# EAGLE design Dashboard r4 (EAGLE 8.4.0)
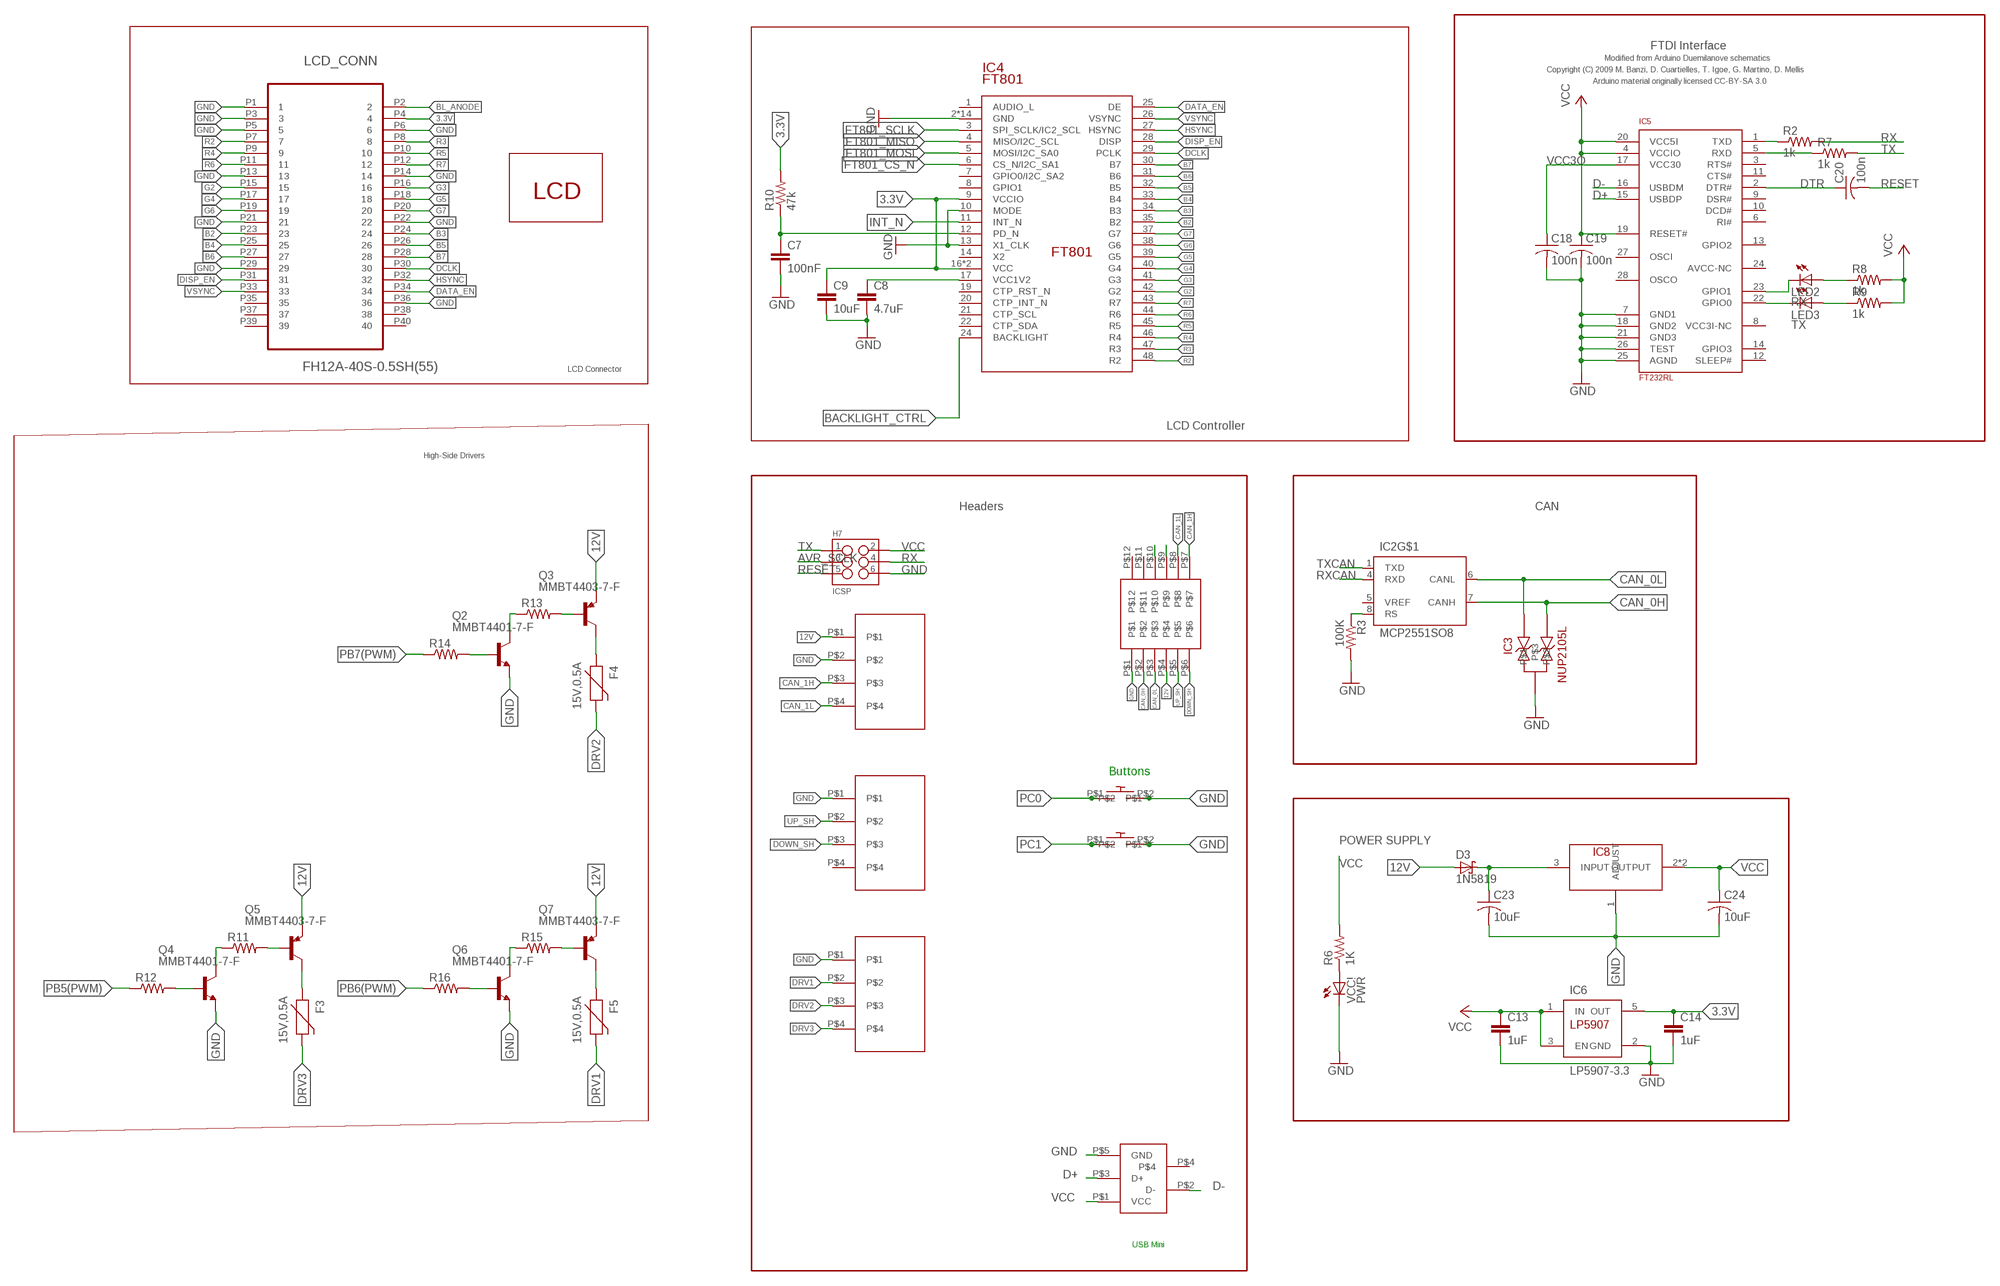
[diagram p0: schematic, sheet 1, part 1 of 2]
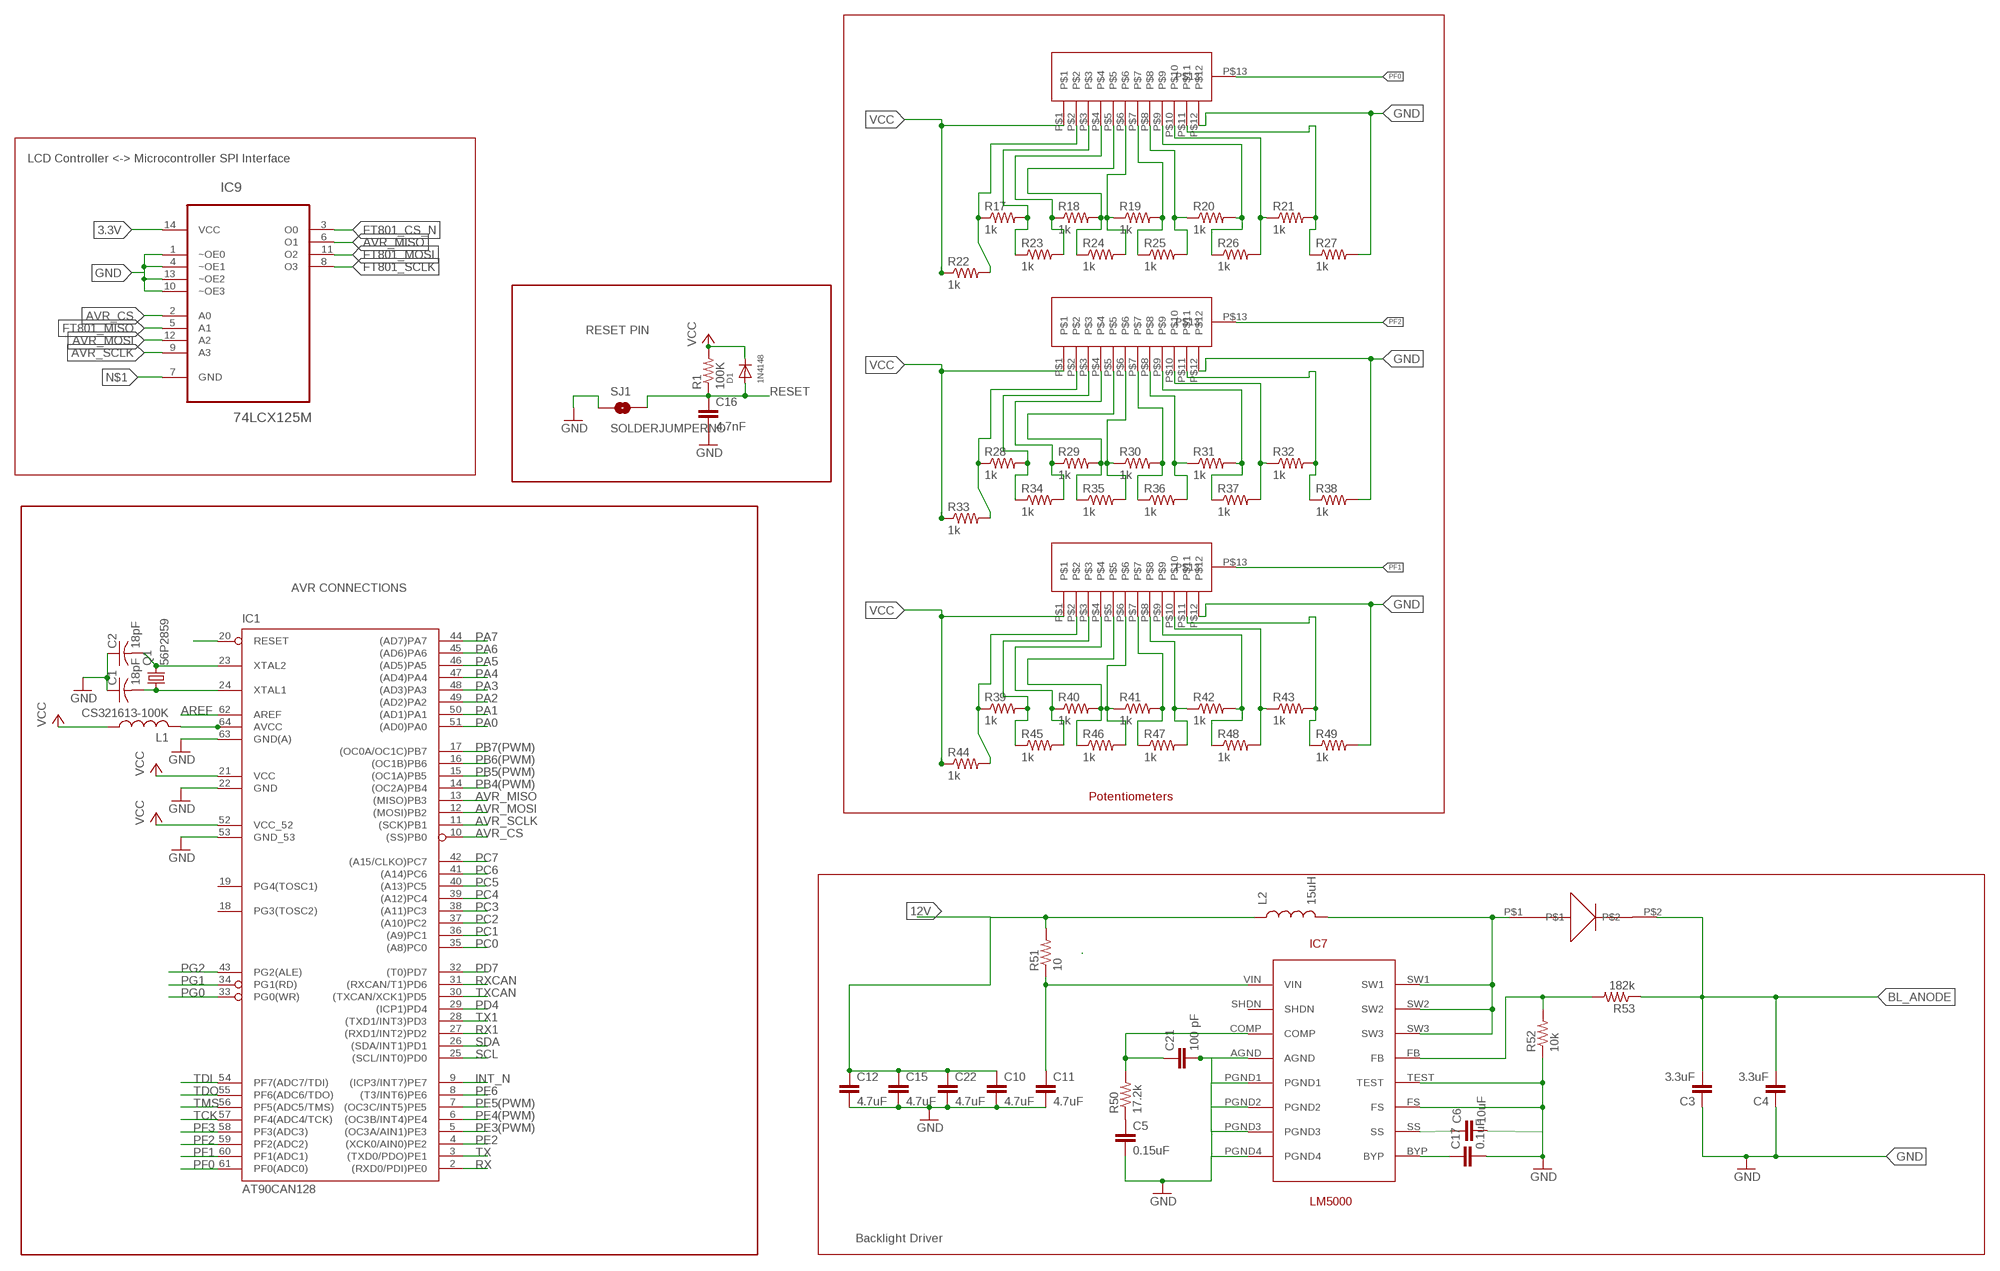
[diagram p1: schematic, sheet 1, part 2 of 2]

## Parts
C1  18pF  C-USC0805  [C0805]
C2  18pF  C-USC0805  [C0805]
C3  3.3uF  CAP0805  [0805]
C4  3.3uF  CAP0805  [0805]
C5  0.15uF  CAP0805  [0805]
C6  10uF  CAP0805  [0805]
C7  100nF  CAP0603-CAP  [0603-CAP]
C8  4.7uF  CAP0805  [0805]
C9  10uF  CAP0603-CAP  [0603-CAP]
C10  4.7uF  CAP0805  [0805]
C11  4.7uF  CAP0805  [0805]
C12  4.7uF  CAP0805  [0805]
C13  1uF  CAP0603-CAP  [0603-CAP]
C14  1uF  CAP0603-CAP  [0603-CAP]
C15  4.7uF  CAP0805  [0805]
C16  4.7nF  CAP0805  [0805]
C17  0.1uF  CAP0805  [0805]
C18  100n  C-USC0805  [C0805]
C19  100n  C-USC0805  [C0805]
C20  100n  C-USC0805  [C0805]
C21  100 pF  CAP0805  [0805]
C22  4.7uF  CAP0805  [0805]
C23  10uF  C-USC0603  [C0603]
C24  10uF  C-USC0603  [C0603]
D1  1N4148  DIODESOD-123  [SOD-123]
D2  B160-FDICT_NB  [B160-FDICT-NB]
D3  1N5819  1N5819-BSOD123  [SOD123]
F3  15V,0.5A  PTCSMD  [PTC-1206]
F4  15V,0.5A  PTCSMD  [PTC-1206]
F5  15V,0.5A  PTCSMD  [PTC-1206]
H7  ICSP  M03X2SMD_FCI  [2X3_SMD_FCI_54202-G30]
IC1  AT90CAN128  [TQFP64]
IC2  MCP2551SO8  [SO08]
IC3  NUP2105L  [SOT-23]
IC4  FT801  [RGZ48_5P15X5P15]
IC5  FT232RL  [SSOP28]
IC6  LP5907-3.3  LP5907  [SOT23-DBV]
IC7  LM5000  [LM5000]
IC8  NCP1117  [SOT-223-4]
IC9  74LCX125M  [SOIC127P600X175-14N]
J1  1734753-1_MINIUSB_CON  [1734753-1_MINIUSB_CON]
J2  EN3C12M26X  [EN3C12M26X]
J3  043650-0409  [043650-0409]
J4  043650-0409  [043650-0409]
J5  043650-0409  [043650-0409]
L1  CS321613-100K  L-USL3216C  [L3216C]
L2  15uH  LTF4022-D  [2-SMD]
LCD  TCG043WQLBAANN-GN00  [TCG043WQLBAANN]
LCD_CONN  FH12A-40S-0.5SH(55)  [HIROSE_FH12A-40S-0.5SH(55)]
LED2  RX  LEDCHIPLED_0805  [CHIPLED_0805]
LED3  TX  LEDCHIPLED_0805  [CHIPLED_0805]
Q1  56P2859  CRYSTALSMD  [HC49UP]
Q2  MMBT4401-7-F  [SOT-23-3]
Q3  MMBT4403-7-F  [SOT-23-3]
Q4  MMBT4401-7-F  [SOT-23-3]
Q5  MMBT4403-7-F  [SOT-23-3]
Q6  MMBT4401-7-F  [SOT-23-3]
Q7  MMBT4403-7-F  [SOT-23-3]
R1  100K  R-US_R0805  [R0805]
R2  1k  R-US_R0805  [R0805]
R3  100K  R-US_R0805  [R0805]
R6  1K  R-US_R0805  [R0805]
R7  1k  R-US_R0805  [R0805]
R8  1k  R-US_R0805  [R0805]
R9  1k  R-US_R0805  [R0805]
R10  47k  RESISTOR0603  [0603-RES]
R11  RESISTOR0603  [0603-RES]
R12  RESISTOR0603  [0603-RES]
R13  RESISTOR0603  [0603-RES]
R14  RESISTOR0603  [0603-RES]
R15  RESISTOR0603  [0603-RES]
R16  RESISTOR0603  [0603-RES]
R17  1k  R-US_R0603  [R0603]
R18  1k  R-US_R0603  [R0603]
R19  1k  R-US_R0603  [R0603]
R20  1k  R-US_R0603  [R0603]
R21  1k  R-US_R0603  [R0603]
R22  1k  R-US_R0603  [R0603]
R23  1k  R-US_R0603  [R0603]
R24  1k  R-US_R0603  [R0603]
R25  1k  R-US_R0603  [R0603]
R26  1k  R-US_R0603  [R0603]
R27  1k  R-US_R0603  [R0603]
R28  1k  R-US_R0603  [R0603]
R29  1k  R-US_R0603  [R0603]
R30  1k  R-US_R0603  [R0603]
R31  1k  R-US_R0603  [R0603]
R32  1k  R-US_R0603  [R0603]
R33  1k  R-US_R0603  [R0603]
R34  1k  R-US_R0603  [R0603]
R35  1k  R-US_R0603  [R0603]
R36  1k  R-US_R0603  [R0603]
R37  1k  R-US_R0603  [R0603]
R38  1k  R-US_R0603  [R0603]
R39  1k  R-US_R0603  [R0603]
R40  1k  R-US_R0603  [R0603]
R41  1k  R-US_R0603  [R0603]
R42  1k  R-US_R0603  [R0603]
R43  1k  R-US_R0603  [R0603]
R44  1k  R-US_R0603  [R0603]
R45  1k  R-US_R0603  [R0603]
R46  1k  R-US_R0603  [R0603]
R47  1k  R-US_R0603  [R0603]
R48  1k  R-US_R0603  [R0603]
R49  1k  R-US_R0603  [R0603]
R50  17.2k  RESISTOR0805-RES  [0805]
R51  10  RESISTOR0603  [0603-RES]
R52  10k  RESISTOR0603  [0603-RES]
R53  182k  RESISTOR0603  [0603-RES]
S1  ROTSWITCH  [ROTSWITCH]
S2  ROTSWITCH  [ROTSWITCH]
S3  ROTSWITCH  [ROTSWITCH]
S4  LP4OA1PBBTG  [LP4OA1PBBTG]
S5  LP4OA1PBBTG  [LP4OA1PBBTG]
SJ1  SOLDERJUMPERNO  [SJ_2S-NO]
VCC!  PWR  LEDCHIPLED_0805  [CHIPLED_0805]

## Nets
3.3V: C9.1 C14.1 IC4.9(VCCIO) IC4.16(VCC) IC4.18(VCC) IC6.5(OUT) IC9.14(VCC) LCD_CONN.P4 R10.2
5V_REG_IN: C23.1 D3.C IC8.3(INPUT)
12V [Class2]: C10.1 C12.1 C15.1 C22.1 D3.A J2.P$4 J3.P$1 L2.1 Q3.P$3(E) Q5.P$3(E) Q7.P$3(E) R51.2
AREF: IC1.62(AREF)
AVR_CS: IC1.10((SS)PB0) IC9.2(A0)
AVR_MISO: IC1.13((MISO)PB3) IC9.6(O1)
AVR_MOSI: IC1.12((MOSI)PB2) IC9.12(A2)
AVR_SCLK: H7.3 IC1.11((SCK)PB1) IC9.9(A3)
B2: IC4.35(B2) LCD_CONN.P23
B3: IC4.34(B3) LCD_CONN.P24
B4: IC4.33(B4) LCD_CONN.P25
B5: IC4.32(B5) LCD_CONN.P26
B6: IC4.31(B6) LCD_CONN.P27
B7: IC4.30(B7) LCD_CONN.P28
BACKLIGHT_CTRL: IC4.24(BACKLIGHT)
BL_ANODE [Class1]: C3.2 C4.2 D2.P$2 LCD_CONN.P2 R53.1
CAN_0H [Class1]: IC2.7(CANH) IC3.2 J2.P$2
CAN_0L [Class1]: IC2.6(CANL) IC3.1 J2.P$3
CAN_1H: J2.P$7 J3.P$3
CAN_1L: J2.P$8 J3.P$4
D+: IC5.15(USBDP) J1.P$3(D+)
D-: IC5.16(USBDM) J1.P$2(D-)
DATA_EN: IC4.25(DE) LCD_CONN.P34
DCLK: IC4.29(PCLK) LCD_CONN.P30
DISP_EN: IC4.28(DISP) LCD_CONN.P31
DOWN_SH: J2.P$6 J4.P$3
DRV1 [Class3]: F5.2 J5.P$2
DRV2 [Class3]: F4.2 J5.P$3
DRV3 [Class3]: F3.2 J5.P$4
DTR: C20.1 IC5.2(DTR#)
FT801_CS_N: IC4.6(CS_N/I2C_SA1) IC9.3(O0)
FT801_MISO: IC4.4(MISO/I2C_SCL) IC9.5(A1)
FT801_MOSI: IC4.5(MOSI/I2C_SA0) IC9.11(O2)
FT801_SCLK: IC4.3(SPI_SCLK/IC2_SCL) IC9.8(O3)
G2: IC4.42(G2) LCD_CONN.P15
G3: IC4.41(G3) LCD_CONN.P16
G4: IC4.40(G4) LCD_CONN.P17
G5: IC4.39(G5) LCD_CONN.P18
G6: IC4.38(G6) LCD_CONN.P19
G7: IC4.37(G7) LCD_CONN.P20
GND [GND]: C1.1 C2.1 C3.1 C4.1 C5.2 C6.2 C7.2 C8.2 C9.2 C10.2 C11.2 C12.2 C13.2 C14.2 C15.2 C16.2 C17.2 C18.2 C19.2 C21.2 C22.2 C23.2 C24.2 H7.6 IC1.22(GND) IC1.53(GND_53) IC1.63(GND(A)) IC3.3 IC4.2(GND) IC4.10(MODE) IC4.13(X1_CLK) IC4.15(GND) IC4.23(GND) IC4.36(GND) IC4.EP(GND) IC4.V_1(GND) IC4.V_2(GND) IC4.V_3(GND) IC4.V_4(GND) IC4.V_5(GND) IC4.V_6(GND) IC4.V_7(GND) IC4.V_8(GND) IC4.V_9(GND) IC5.7(GND1) IC5.18(GND2) IC5.21(GND3) IC5.25(AGND) IC5.26(TEST) IC6.2(GND) IC7.AGND IC7.FS IC7.PGND1 IC7.PGND2 IC7.PGND3 IC7.PGND4 IC7.TEST IC8.1(ADJUST) IC9.1(~OE0) IC9.4(~OE1) IC9.10(~OE3) IC9.13(~OE2) J1.P$5(GND) J2.P$1 J3.P$2 J4.P$1 J5.P$1 LCD_CONN.P1 LCD_CONN.P3 LCD_CONN.P5 LCD_CONN.P6 LCD_CONN.P13 LCD_CONN.P14 LCD_CONN.P21 LCD_CONN.P22 LCD_CONN.P29 LCD_CONN.P36 Q2.P$3(E) Q4.P$3(E) Q6.P$3(E) R3.2 R27.2 R38.2 R49.2 R52.1 S1.P$12 S2.P$12 S3.P$12 S4.P$2 S5.P$2 SJ1.1 VCC!.C
HSYNC: IC4.27(HSYNC) LCD_CONN.P32
INT_N: IC1.9((ICP3/INT7)PE7) IC4.11(INT_N)
M8RXD: IC5.1(TXD) R2.1
M8TXD: IC5.5(RXD) R7.1
N$1 [Class2]: IC9.7(GND)
N$2: C8.1 IC4.17(VCC1V2)
N$3: C7.1 IC4.12(PD_N) R10.1
N$4: C5.1 R50.1
N$6: IC2.8(RS) R3.1
N$9: R6.1 VCC!.A
N$11: C1.2 IC1.24(XTAL1) Q1.1
N$22: IC1.64(AVCC) L1.2
N$27 [Class3]: Q4.P$2(B) R12.2
N$28 [Class3]: Q5.P$2(B) R11.2
N$29 [Class3]: Q4.P$1(C) R11.1
N$30 [Class3]: F3.1 Q5.P$1(C)
N$31 [Class3]: Q2.P$2(B) R14.2
N$32: IC5.23(GPIO1) LED2.C
N$33 [Class3]: Q3.P$2(B) R13.2
N$34: IC5.22(GPIO0) LED3.C
N$35: LED2.A R8.1
N$36: LED3.A R9.1
N$37 [Class3]: Q2.P$1(C) R13.1
N$38 [Class3]: F4.1 Q3.P$1(C)
N$39 [Class3]: Q6.P$2(B) R16.2
N$40 [Class3]: Q7.P$2(B) R15.2
N$41 [Class3]: Q6.P$1(C) R15.1
N$42 [Class3]: F5.1 Q7.P$1(C)
N$43: R17.1 R22.2 S1.P$2
N$44: R17.2 R23.1 S1.P$3
N$45: R18.1 R23.2 S1.P$4
N$46: R18.2 R24.1 S1.P$5
N$47: R20.1 R25.2 S1.P$8
N$48: R20.2 R26.1 S1.P$9
N$49: R19.1 R24.2 S1.P$6
N$50: R19.2 R25.1 S1.P$7
N$51: R21.1 R26.2 S1.P$10
N$52: R28.1 R33.2 S2.P$2
N$53: R21.2 R27.1 S1.P$11
N$54: R28.2 R34.1 S2.P$3
N$55: R29.1 R34.2 S2.P$4
N$56: R29.2 R35.1 S2.P$5
N$57: R31.1 R36.2 S2.P$8
N$58: R31.2 R37.1 S2.P$9
N$59: R30.1 R35.2 S2.P$6
N$60: R30.2 R36.1 S2.P$7
N$61: R32.1 R37.2 S2.P$10
N$62: R32.2 R38.1 S2.P$11
N$63: R39.1 R44.2 S3.P$2
N$64: R39.2 R45.1 S3.P$3
N$65: R40.1 R45.2 S3.P$4
N$66: R40.2 R46.1 S3.P$5
N$67: R42.1 R47.2 S3.P$8
N$68: R42.2 R48.1 S3.P$9
N$69: R41.1 R46.2 S3.P$6
N$70: R41.2 R47.1 S3.P$7
N$71: R43.1 R48.2 S3.P$10
N$72: R43.2 R49.1 S3.P$11
N$75: C21.1 IC7.COMP R50.2
N$77: C11.1 IC7.VIN R51.1
N$79: D2.P$1 IC7.SW1 IC7.SW2 IC7.SW3 L2.2
N$80: J2.P$10
N$81: J2.P$9
N$82: IC7.FB R52.2 R53.2
N$85: C6.1 IC7.SS
N$87: C17.1 IC7.BYP
PA0: IC1.51((AD0)PA0)
PA1: IC1.50((AD1)PA1)
PA2: IC1.49((AD2)PA2)
PA3: IC1.48((AD3)PA3)
PA4: IC1.47((AD4)PA4)
PA5: IC1.46((AD5)PA5)
PA6: IC1.45((AD6)PA6)
PA7: IC1.44((AD7)PA7)
PB4(PWM): IC1.14((OC2A)PB4)
PB5(PWM): IC1.15((OC1A)PB5) R12.1
PB6(PWM): IC1.16((OC1B)PB6) R16.1
PB7(PWM): IC1.17((OC0A/OC1C)PB7) R14.1
PC0: IC1.35((A8)PC0) S4.P$1
PC1: IC1.36((A9)PC1) S5.P$1
PC2: IC1.37((A10)PC2)
PC3: IC1.38((A11)PC3)
PC4: IC1.39((A12)PC4)
PC5: IC1.40((A13)PC5)
PC6: IC1.41((A14)PC6)
PC7: IC1.42((A15/CLKO)PC7)
PD4: IC1.29((ICP1)PD4)
PD7: IC1.32((T0)PD7)
PE2: IC1.4((XCK0/AIN0)PE2)
PE3(PWM): IC1.5((OC3A/AIN1)PE3)
PE4(PWM): IC1.6((OC3B/INT4)PE4)
PE5(PWM): IC1.7((OC3C/INT5)PE5)
PE6: IC1.8((T3/INT6)PE6)
PF0: IC1.61(PF0(ADC0)) S1.P$13
PF1: IC1.60(PF1(ADC1)) S3.P$13
PF2: IC1.59(PF2(ADC2)) S2.P$13
PF3: IC1.58(PF3(ADC3))
PG0: IC1.33(PG0(WR))
PG1: IC1.34(PG1(RD))
PG2: IC1.43(PG2(ALE))
R2: IC4.48(R2) LCD_CONN.P7
R3: IC4.47(R3) LCD_CONN.P8
R4: IC4.46(R4) LCD_CONN.P9
R5: IC4.45(R5) LCD_CONN.P10
R6: IC4.44(R6) LCD_CONN.P11
R7: IC4.43(R7) LCD_CONN.P12
RESET [Class1]: C16.1 C20.2 D1.A H7.5 IC1.20(RESET) R1.1 SJ1.2
RX: H7.4 IC1.2((RXD0/PDI)PE0) R2.2
RX1: IC1.27((RXD1/INT2)PD2)
RXCAN: IC1.31((RXCAN/T1)PD6) IC2.4(RXD)
SCL: IC1.25((SCL/INT0)PD0)
SDA: IC1.26((SDA/INT1)PD1)
TCK: IC1.57(PF4(ADC4/TCK))
TDI: IC1.54(PF7(ADC7/TDI))
TDO: IC1.55(PF6(ADC6/TDO))
TMS: IC1.56(PF5(ADC5/TMS))
TX: H7.1 IC1.3((TXD0/PDO)PE1) R7.2
TX1: IC1.28((TXD1/INT3)PD3)
TXCAN: IC1.30((TXCAN/XCK1)PD5) IC2.1(TXD)
UP_SH [GND]: J2.P$5 J4.P$2
VCC [Class1]: C13.1 C19.1 C24.1 D1.C H7.2 IC1.21(VCC) IC1.52(VCC_52) IC5.4(VCCIO) IC5.19(RESET#) IC5.20(VCC5I) IC6.1(IN) IC6.3(EN) IC8.2(OUTPUT) IC8.4(OUTPUT) J1.P$1(VCC) L1.1 R1.2 R6.2 R8.2 R9.2 R22.1 R33.1 R44.1 S1.P$1 S2.P$1 S3.P$1
VCC3O: C18.1 IC5.17(VCC30)
VSYNC: IC4.26(VSYNC) LCD_CONN.P33
XTAL1: C2.2 IC1.23(XTAL2) Q1.2
Unconnected: IC1.18(PG3(TOSC2)) IC1.19(PG4(TOSC1)) IC2.5(VREF) IC4.1(AUDIO_L) IC4.7(GPIO0/I2C_SA2) IC4.8(GPIO1) IC4.14(X2) IC4.19(CTP_RST_N) IC4.20(CTP_INT_N) IC4.21(CTP_SCL) IC4.22(CTP_SDA) IC5.3(RTS#) IC5.6(RI#) IC5.8(VCC3I-NC) IC5.9(DSR#) IC5.10(DCD#) IC5.11(CTS#) IC5.12(SLEEP#) IC5.13(GPIO2) IC5.14(GPIO3) IC5.24(AVCC-NC) IC5.27(OSCI) IC5.28(OSCO) IC7.SHDN J1.P$4 J2.P$11 J2.P$12 J4.P$4 LCD_CONN.P35 LCD_CONN.P37 LCD_CONN.P38 LCD_CONN.P39 LCD_CONN.P40

## Notes on the sheet
- LCD Controller <-> Microcontroller SPI Interface
- FTDI Interface
- Modified from Arduino Duemilanove schematics
- Copyright (C) 2009 M. Banzi, D. Cuartielles, T. Igoe, G. Martino, D. Mellis
- Arduino material originally licensed CC-BY-SA 3.0
- RESET PIN
- AVR CONNECTIONS
- LCD Connector
- LCD Controller
- High-Side Drivers
- Headers | CAN
- Potentiometers
- Buttons
- POWER SUPPLY
- Backlight Driver
- USB Mini

## Power pins joined to a net without a drawn wire
GND: IC2.2(GND)
VCC: IC2.3(VCC)

## Library data of the parts
C1 C2 C18-C20 C23 C24 = rcl:C-US: CAPACITOR, American symbol
C3-C8 C10-C17 C21 C22 = SparkFun-Capacitors:CAP: Capacitor Standard 0603 ceramic capacitor, and 0.1" leaded capacitor.
C9 = SparkFun-Passives:CAP: Capacitor Standard 0603 ceramic capacitor, and 0.1" leaded capacitor.
D1 = adafruit:DIODE: Diode SMADIODE - SMA Surface Mount Package 20V 1A Schottky Diode Digikey: 641-1014-6-ND DO-1N4148 - Through Hole Small Current Diode SOD-123 20V 1 A (.5mV Vf) Schottky Diode - Digikey: MBRX120TPMSCT-ND SOD-323 10V 570mA (.38mV Vf, 3ns) Schottky Diode - Digikey: ZLLS410CT-ND SOD-523 30V 30mA Schottky Diode (RB751S-40TE61) - Digikey: RB751S-40TE61CT-ND SOT23-R/W - SOT23 Package (R = Solder Paste/Reflow Ovens, W = Hand-Soldering) BAT54Film 40V 300mA - Digikey: 497-7162-1-ND
D2 = diodes-inc-e14:B160-FDICT_NB
D3 = diode:1N581*: 1.0A SCHOTTKY BARRIER RECTIFIER Source: http://www.diodes.com/datasheets/ds23001.pdf
F3-F5 = SparkFun:PTC: Resettable Fuse PTC Resettable Fuse. Spark Fun Electronics SKU : COM-08357
H7 = SparkFun-Connectors:M03X2: 2x3 .1" header. Shrouded, with keying- CONN-10681 SMT- CONN-11415 Pogo pins- HW-11044
IC1 = at90can128:AT90CAN128
IC2 = can:MCP2551: CAN Tranceiver Microchip
IC3 = Artificial Science:NUP2105L
IC4 = ftdichip:FT801: IC TFT LCD CONTROLLER 48VQFN
IC5 = SmartPrj:FT232RL
IC6 = texas:LP5907
IC7 = texas:LM5000
IC8 = on-semiconductor:NCP1117
IC9 = Fairchild_By_element14_Batch_1:74LCX125M: Low Voltage Quad Buffer with 5V Tolerant Inputs and Outputs; MPN: 74LCX125M; OC_FARNELL: 1013776; OC_NEWARK: 78K6286; PACKAGE: SOIC-14; SUPPLIER: Fairchild
J1 = us-te-con:1734753-1_MINIUSB_CON
J2 = molex:EN3C12M26X
J3-J5 = molex:043650-0409
L1 = rcl:L-US: INDUCTOR, American symbol
L2 = tdk:LTF4022-D: LTF4022
LCD = kyocera:TCG043WQLBAANN-GN00
LCD_CONN = hirose:FH12A-40S-0.5SH(55): SOCKET FFC/FPC, ZIF, 0.5MM, 40WAY; MPN: FH12A-40S-0.5SH(55); OC_FARNELL: 1324569; OC_NEWARK: 34M6194; PACKAGE: SOCKET FFC/FPC, ZIF, 0.5MM, 40WAY; SUPPLIER: Hirose
LED2 LED3 VCC! = led:LED: LED OSRAM: - CHIPLED LG R971, LG N971, LY N971, LG Q971, LY Q971, LO R971, LY R971 LH N974, LH R974 LS Q976, LO Q976, LY Q976 LO Q996 - Hyper CHIPLED LW Q18S LB Q993, LB Q99A, LB R99A - SideLED LS A670, LO A670, LY A670, LG A670, LP A670 LB A673, LV A673, LT A673, LW A673 LH A674 LY A675 LS A676, LA A676, LO A676, LY A676, LW A676 LS A679, LY A679, LG A679 - Hyper Micro SIDELED® LS Y876, LA Y876, LO Y876, LY Y876 LT Y87S - SmartLED LW L88C, LW L88S LB L89C, LB L89S, LG L890 LS L89K, LO L89K, LY L89K LS L896, LA L896, LO L896, LY L896 - TOPLED LS T670, LO T670, LY T670, LG T670, LP T670 LSG T670, LSP T670, LSY T670, LOP T670, LYG T670 LG T671, LOG T671, LSG T671 LB T673, LV T673, LT T673, LW T673 LH T674 LS T676, LA T676, LO T676, LY T676, LB T676, LH T676, LSB T676, LW T676 LB T67C, LV T67C, LT T67C, LS T67K, LO T67K, LY T67K, LW E67C LS E67B, LA E67B, LO E67B, LY E67B, LB E67C, LV E67C, LT E67C LW T67C LS T679, LY T679, LG T679 LS T770, LO T770, LY T770, LG T770, LP T770 LB T773, LV T773, LT T773, LW T773 LH T774 LS E675, LA E675, LY E675, LS T675 LS T776, LA T776, LO T776, LY T776, LB T776 LHGB T686 LT T68C, LB T68C - Hyper Mini TOPLED® LB M676 - Mini TOPLED Santana® LG M470 LS M47K, LO M47K, LY M47K Source: http://www.osram.convergy.de LUXEON: - LUMILED® LXK2-PW12-R00, LXK2-PW12-S00, LXK2-PW14-U00, LXK2-PW14-V00 LXK2-PM12-R00, LXK2-PM12-S00, LXK2-PM14-U00 LXK2-PE12-Q00, LXK2-PE12-R00, LXK2-PE12-S00, LXK2-PE14-T00, LXK2-PE14-U00 LXK2-PB12-K00, LXK2-PB12-L00, LXK2-PB12-M00, LXK2-PB14-N00, LXK2-PB14-P00, LXK2-PB14-Q00 LXK2-PR12-L00, LXK2-PR12-M00, LXK2-PR14-Q00, LXK2-PR14-R00 LXK2-PD12-Q00, LXK2-PD12-R00, LXK2-PD12-S00 LXK2-PH12-R00, LXK2-PH12-S00 LXK2-PL12-P00, LXK2-PL12-Q00, LXK2-PL12-R00 Source: www.luxeon.com KINGBRIGHT: KA-3528ASYC Source: www.kingbright.com
Q1 = SparkFun-FreqCtrl:CRYSTAL: Various standard crystals. Proven footprints. Spark Fun Electronics SKU : COM-00534
Q2 Q4 Q6 = formula electric:MMBT4401-7-F
Q3 Q5 Q7 = formula electric:MMBT4403-7-F
R1-R3 R6-R9 R17-R49 = rcl:R-US_: RESISTOR, American symbol
R10-R16 R51-R53 = SparkFun-Resistors:RESISTOR: Resistor Basic schematic elements and footprints for 0603, 1206, and PTH resistors.
R50 = SparkFun-Passives:RESISTOR: Resistor Basic schematic elements and footprints for 0603, 1206, and PTH resistors.
S1-S3 = DashAndCAN library:ROTSWITCH
S4 S5 = e-switch:LP4OA1PBBTG
SJ1 = SparkFun-Passives:SOLDERJUMPER: Solder Jumper Standard SMD solder jumper. Used to automate production. Two varients : Normally Open and Normally Closed are the same, but have different paste layers. NC will have a large amount of paste and should jumper during reflow.

## Net classes
1 Class1: width 0.508 mm, clearance 0.178 mm
2 Class2: width 0.635 mm, clearance 0.178 mm
3 Class3: width 0.559 mm
4 GND: width 0.406 mm

## Board
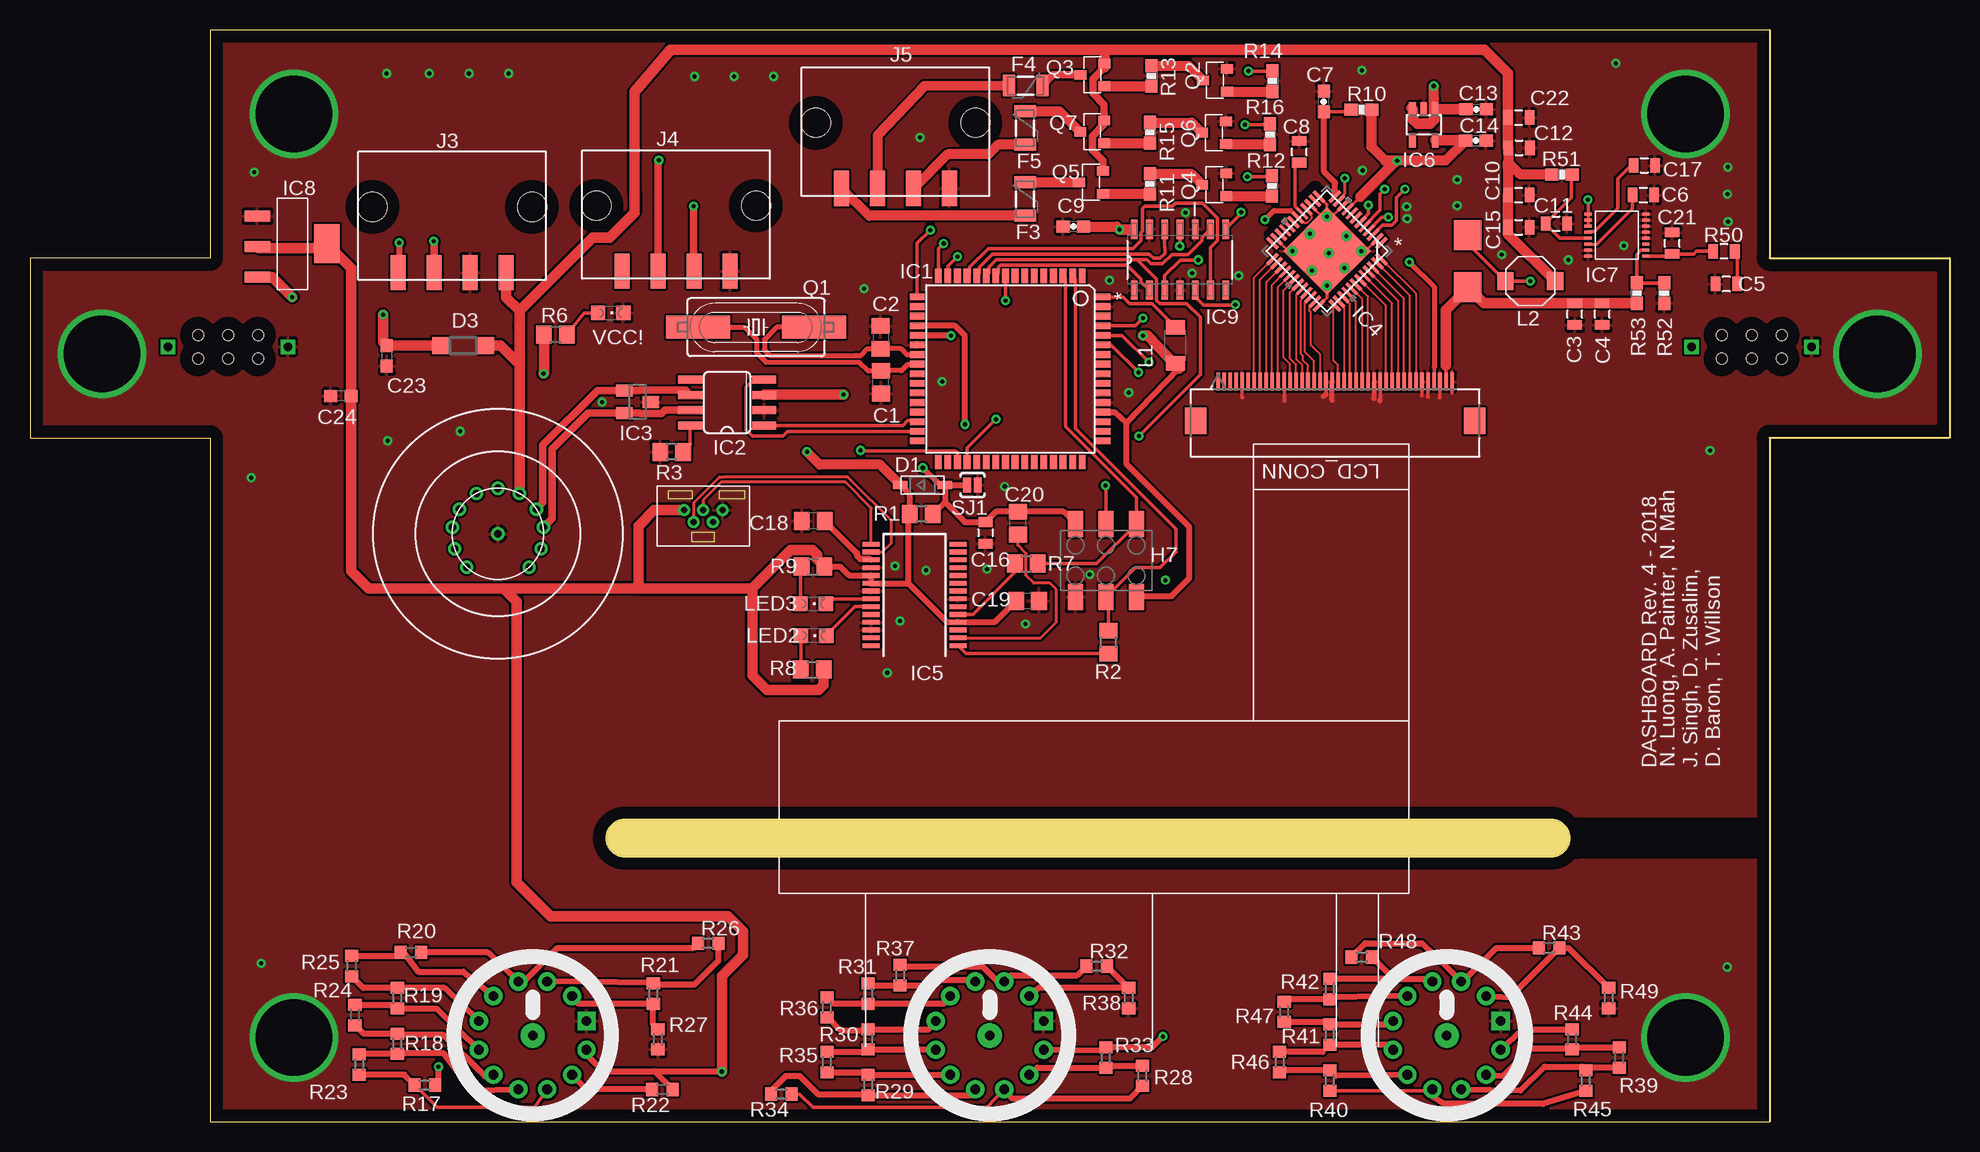
[diagram p2: board, top side]
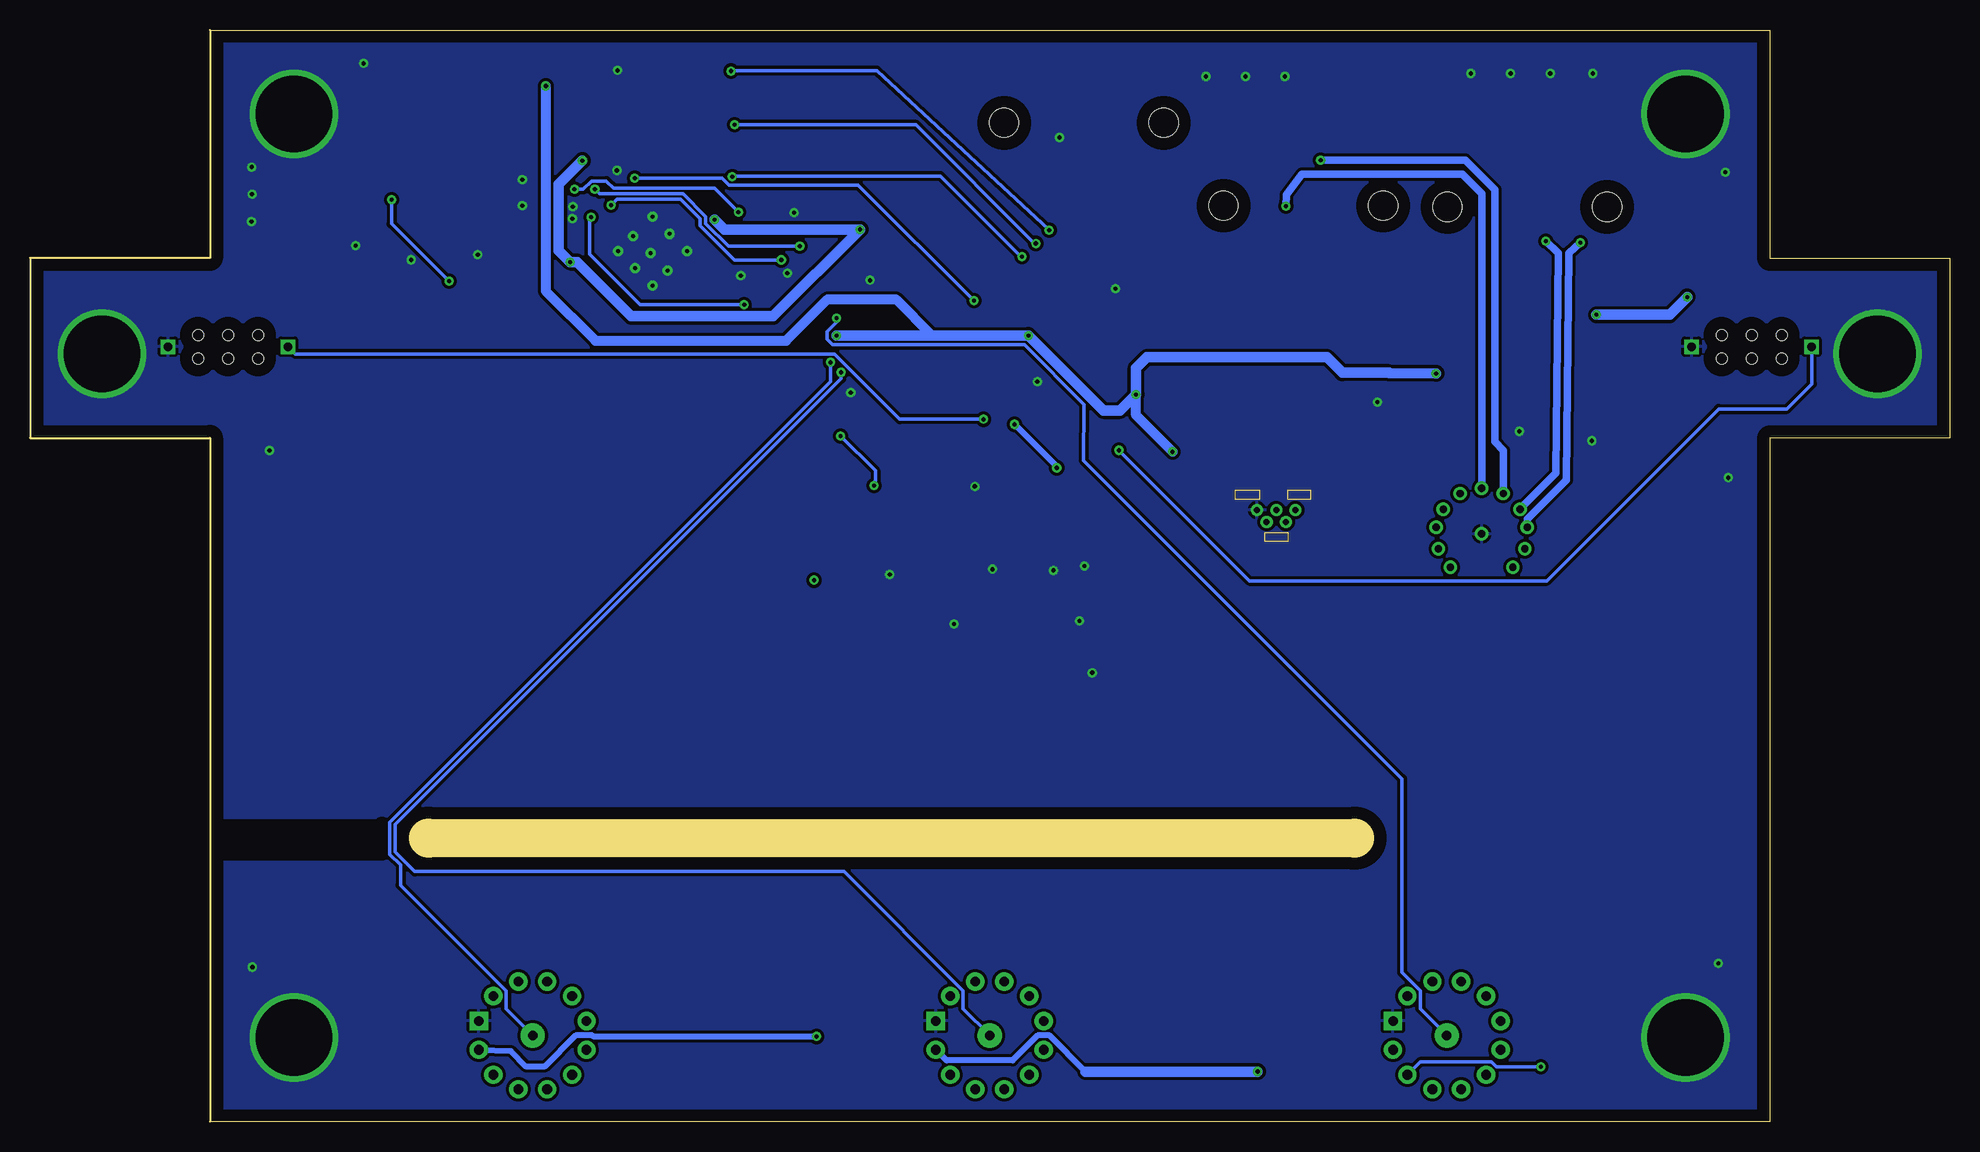
[diagram p3: board, bottom side, seen from below]

Size 160 x 91 mm. Coordinates in mm from the lower left corner, seen from the top.
Outline: 15,0 145,0 145,57 160,57 160,72 145,72 145,91 15,91 15,72 0,72 0,57 15,57 15,0
Outline: 49.8,22.1 126.76,22.1 126.76,25.15 49.54,25.15 49.8,22.1
Outline: circle at 49.57,23.62 radius 1.52
Outline: circle at 126.79,23.62 radius 1.52
Copper layers (1*16): Top 0.035mm / dielectric 1.5mm / Bottom 0.035mm
Design rules "default *": minimum track width 4mil, minimum drill 0.35mm, track to track 6mil, track to pad 6mil, pad to pad 6mil, via to via 6mil, smd to smd 6mil, copper to edge 40mil, drill to drill 5mil, minimum pad ring 10mil, minimum via ring 8mil, stop-mask expansion 4mil, vias tented up to drill 0mil, thermal gap 10mil
tKeepout: area 53,37 to 63,47; area 97,37 to 107,47
tRestrict: area 129,22.2 to 150.6,25; area 103.1,74 to 103.5,74.3; area 105.9,76.9 to 108,78.1; area 107.6,67.5 to 107.9,67.8
bRestrict: area 130.6,22.4 to 146.3,24.7
Milling: 2 lines

### Footprints (pad centres in the part's own frame; a part is rotated, then mirrored left to right if it is on the bottom)
C0805 = smd 1.3 x 1.5: 1 -0.95,0; 2 0.95,0
0805 = smd 0.8 x 1.2: 1 -0.9,0; 2 0.9,0
0603-CAP = smd 1.1 x 1: 1 -0.85,0; 2 0.85,0
C0603 = smd 1.1 x 1: 1 -0.85,0; 2 0.85,0
SOD-123 = smd 1.2 x 0.7: A 1.85,0; C -1.85,0
B160-FDICT-NB = smd 2.5 x 2.3: P$1 -2.15,0; P$2 2.15,0
SOD123 = smd 1.4 x 1.4: A 1.9,0; C -1.9,0
PTC-1206 = smd 1 x 1.8: 1 -1.4,0; 2 1.4,0
2X3_SMD_FCI_54202-G30 = smd 1.27 x 2.18: 1 -2.54,-3.05; 2 -2.54,3.05; 3 0,-3.05; 4 0,3.05; 5 2.54,-3.05; 6 2.54,3.05
TQFP64 = smd 1.194 x 0.559: 1 -7.76,6; 2 -7.76,5.2; 3 -7.76,4.4; 4 -7.76,3.6; 5 -7.76,2.8; 6 -7.76,2; 7 -7.76,1.2; 8 -7.76,0.4; 9 -7.76,-0.4; 10 -7.76,-1.2; 11 -7.76,-2; 12 -7.76,-2.8; 13 -7.76,-3.6; 14 -7.76,-4.4; 15 -7.76,-5.2; 16 -7.76,-6; 33 7.76,-6; 34 7.76,-5.2; 35 7.76,-4.4; 36 7.76,-3.6; 37 7.76,-2.8; 38 7.76,-2; 39 7.76,-1.2; 40 7.76,-0.4; 41 7.76,0.4; 42 7.76,1.2; 43 7.76,2; 44 7.76,2.8; 45 7.76,3.6; 46 7.76,4.4; 47 7.76,5.2; 48 7.76,6 | smd 0.559 x 1.194: 17 -6,-7.76; 18 -5.2,-7.76; 19 -4.4,-7.76; 20 -3.6,-7.76; 21 -2.8,-7.76; 22 -2,-7.76; 23 -1.2,-7.76; 24 -0.4,-7.76; 25 0.4,-7.76; 26 1.2,-7.76; 27 2,-7.76; 28 2.8,-7.76; 29 3.6,-7.76; 30 4.4,-7.76; 31 5.2,-7.76; 32 6,-7.76; 49 6,7.76; 50 5.2,7.76; 51 4.4,7.76; 52 3.6,7.76; 53 2.8,7.76; 54 2,7.76; 55 1.2,7.76; 56 0.4,7.76; 57 -0.4,7.76; 58 -1.2,7.76; 59 -2,7.76; 60 -2.8,7.76; 61 -3.6,7.76; 62 -4.4,7.76; 63 -5.2,7.76; 64 -6,7.76
SO08 = smd 0.66 x 2.032: 1 -1.905,-3.073; 2 -0.635,-3.073; 3 0.635,-3.073; 4 1.905,-3.073; 5 1.905,3.073; 6 0.635,3.073; 7 -0.635,3.073; 8 -1.905,3.073
SOT-23 = smd 1 x 1.4: 1 -0.95,-1.1; 2 0.95,-1.1; 3 0,1.1
RGZ48_5P15X5P15 = smd 1.245 x 0.279: 1 -3.683,2.743; 2 -3.683,2.261; 3 -3.683,1.753; 4 -3.683,1.245; 5 -3.683,0.762; 6 -3.683,0.254; 7 -3.683,-0.254; 8 -3.683,-0.762; 9 -3.683,-1.245; 10 -3.683,-1.753; 11 -3.683,-2.261; 12 -3.683,-2.743; 25 3.683,-2.743; 26 3.683,-2.261; 27 3.683,-1.753; 28 3.683,-1.245; 29 3.683,-0.762; 30 3.683,-0.254; 31 3.683,0.254; 32 3.683,0.762; 33 3.683,1.245; 34 3.683,1.753; 35 3.683,2.261; 36 3.683,2.743 | smd 0.279 x 1.245: 13 -2.743,-3.683; 14 -2.261,-3.683; 15 -1.753,-3.683; 16 -1.245,-3.683; 17 -0.762,-3.683; 18 -0.254,-3.683; 19 0.254,-3.683; 20 0.762,-3.683; 21 1.245,-3.683; 22 1.753,-3.683; 23 2.261,-3.683; 24 2.743,-3.683; 37 2.743,3.683; 38 2.261,3.683; 39 1.753,3.683; 40 1.245,3.683; 41 0.762,3.683; 42 0.254,3.683; 43 -0.254,3.683; 44 -0.762,3.683; 45 -1.245,3.683; 46 -1.753,3.683; 47 -2.261,3.683; 48 -2.743,3.683 | smd 5.156 x 5.156: EP 0,0 | drill 0.33: V_1 -2.032,2.032; V_2 0,2.032; V_3 2.032,2.032; V_4 -2.032,0.254; V_5 0,0.254; V_6 2.032,0.254; V_7 -2.032,-2.032; V_8 0,-2.032; V_9 2.032,-2.032
SSOP28 = smd 0.381 x 1.499: 1 -4.225,-3.625; 2 -3.575,-3.625; 3 -2.925,-3.625; 4 -2.275,-3.625; 5 -1.625,-3.625; 6 -0.975,-3.625; 7 -0.325,-3.625; 8 0.325,-3.625; 9 0.975,-3.625; 10 1.625,-3.625; 11 2.275,-3.625; 12 2.925,-3.625; 13 3.575,-3.625; 14 4.225,-3.625; 15 4.225,3.625; 16 3.575,3.625; 17 2.925,3.625; 18 2.275,3.625; 19 1.625,3.625; 20 0.975,3.625; 21 0.325,3.625; 22 -0.325,3.625; 23 -0.975,3.625; 24 -1.625,3.625; 25 -2.275,3.625; 26 -2.925,3.625; 27 -3.575,3.625; 28 -4.225,3.625
SOT23-DBV = smd 0.55 x 1.2: 1 -0.95,-1.3; 2 0,-1.3; 3 0.95,-1.3; 4 0.95,1.3; 5 -0.95,1.3
LM5000 = smd 0.25 x 0.6: AGND 1.75,-0.6; BYP 2.25,4.2; COMP 0.25,-0.6; FB 0.75,-0.6; FS 0.75,4.2; PGND1 2.25,-0.6; PGND2 2.75,-0.6; PGND3 3.25,-0.6; PGND4 3.75,-0.6; SHDN 1.25,-0.6; SS 1.25,4.2; SW1 3.75,4.2; SW2 3.25,4.2; SW3 2.75,4.2; TEST 0.25,4.2; VIN 1.75,4.2
SOT-223-4 = smd 0.95 x 2.15: 1 -2.3,-2.9; 2 0.24,-2.9; 3 2.78,-2.9 | smd 3.25 x 2.15: 4 0,2.9
SOIC127P600X175-14N = smd 1.6 x 0.559: 1 -2.54,3.81; 2 -2.54,2.54; 3 -2.54,1.27; 4 -2.54,0; 5 -2.54,-1.27; 6 -2.54,-2.54; 7 -2.54,-3.81; 8 2.54,-3.81; 9 2.54,-2.54; 10 2.54,-1.27; 11 2.54,0; 12 2.54,1.27; 13 2.54,2.54; 14 2.54,3.81
1734753-1_MINIUSB_CON = drill 0.5: P$1 -0.5,-1.6; P$2 0.5,-0.8; P$3 -0.5,0; P$4 0.5,0.8; P$5 -0.5,1.6
EN3C12M26X = drill 0.6: P$1 0,0; P$2 3.8,0.55; P$3 3.2,2.05; P$4 1.8,3.35; P$5 0,3.8; P$6 -1.8,3.35; P$7 -3.2,2.05; P$8 -3.8,0.55; P$9 -3.6,-1.25; P$10 3.6,-1.25; P$11 -2.6,-2.8; P$12 2.6,-2.8
043650-0409 = smd 1.27 x 2.92: P$1 -4.5,5.47; P$2 -1.5,5.47; P$3 1.5,5.47; P$4 4.5,5.47 | hole 2.41: -6.65,0; 6.65,0
L3216C = smd 1.2 x 1.6: 1 -1.5,0; 2 1.5,0
2-SMD = smd 1.35 x 1.5: 1 -2.075,0; 2 2.075,0
HIROSE_FH12A-40S-0.5SH(55) = smd 1.803 x 2.21: 41 -11.633,6.68; 42 11.633,6.68 | smd 0.305 x 1.499: P1 -9.754,3.429; P2 -9.246,3.429; P3 -8.738,3.429; P4 -8.255,3.429; P5 -7.747,3.429; P6 -7.239,3.429; P7 -6.756,3.429; P8 -6.248,3.429; P9 -5.74,3.429; P10 -5.258,3.429; P11 -4.75,3.429; P12 -4.242,3.429; P13 -3.759,3.429; P14 -3.251,3.429; P15 -2.743,3.429; P16 -2.261,3.429; P17 -1.753,3.429; P18 -1.245,3.429; P19 -0.762,3.429; P20 -0.254,3.429; P21 0.254,3.429; P22 0.762,3.429; P23 1.245,3.429; P24 1.753,3.429; P25 2.261,3.429; P26 2.743,3.429; P27 3.251,3.429; P28 3.759,3.429; P29 4.242,3.429; P30 4.75,3.429; P31 5.258,3.429; P32 5.74,3.429; P33 6.248,3.429; P34 6.756,3.429; P35 7.239,3.429; P36 7.747,3.429; P37 8.255,3.429; P38 8.738,3.429; P39 9.246,3.429; P40 9.754,3.429
CHIPLED_0805 = smd 1.2 x 1.2: A 0,-1.05; C 0,1.05
HC49UP = smd 5.334 x 1.93: 1 -4.826,0; 2 4.826,0
SOT-23-3 = smd 0.8 x 0.976: P$1 0,1; P$2 -0.95,-1; P$3 0.95,-1
R0805 = smd 1.3 x 1.5: 1 -0.95,0; 2 0.95,0
0603-RES = smd 1.1 x 1: 1 -0.85,0; 2 0.85,0
R0603 = smd 1 x 1.1: 1 -0.85,0; 2 0.85,0
ROTSWITCH = drill 0.8 pad 1.524: P$1 4.49,-1.203; P$2 3.287,-3.287; P$3 1.203,-4.491; P$4 -1.203,-4.491; P$5 -3.287,-3.287; P$6 -4.491,-1.203; P$7 -4.49,1.203; P$8 -3.287,3.287; P$9 -1.203,4.49; P$10 1.203,4.49; P$11 3.287,3.287 | drill 0.8 pad 1.524 square: P$12 4.49,1.203 | drill 0.8 pad 2.032: P$13 0,0
LP4OA1PBBTG = drill 0.7 square: P$1 -5,0; P$2 5,0 | hole 0.9: 0,-0.985; 2.5,-0.985; -2.5,-0.985; -2.5,0.985; 0,0.985; 2.5,0.985
SJ_2S-NO = smd 0.635 x 1.27: 1 -0.45,0; 2 0.45,0

### Placement (x,y rotation side)
C1  70.92,61.64 90 top
C2  70.91,65.37 270 top
C3  128.77,67.31 90 top
C4  131.05,67.31 90 top
C5  141.4,69.82 180 top
C6  134.48,77.24 0 top
C7  107.84,85.03 90 top
C8  105.8,80.83 90 top
C9  86.97,74.62 180 top
C10  124.09,77.24 0 top
C11  127.22,74.85 0 top
C12  124.12,81.18 0 top
C13  120.56,84.38 0 top
C14  120.52,81.79 0 top
C15  124.09,74.55 0 top
C16  79.65,49.08 270 top
C17  134.56,79.71 0 top
C18  65.3,50.06 180 top
C19  83.15,43.41 0 top
C20  82.35,49.89 90 top
C21  136.89,73.22 90 top
C22  124.09,83.69 0 top
C23  29.73,63.83 270 top
C24  25.92,60.48 180 top
D1  74.4,53.07 0 top
D2  119.83,71.73 270 top
D3  36.11,64.69 0 top
F3  82.94,76.9 270 top
F4  82.99,86.36 180 top
F5  82.94,82.82 270 top
H7  89.69,46.78 180 top
IC1  81.71,62.74 270 top
IC2  58.11,59.94 90 top
IC3  50.65,60 270 top
IC4  108.11,72.56 225 top
IC5  73.73,43.9 90 top
IC6  116.18,83.1 180 top
IC7  134.08,71.91 90 top
IC8  21.86,73.18 270 top
IC9  95.85,71.84 90 top
J1  56.12,50.48 270 top
J2  39,49 0 top
J3  35.19,76.25 180 top
J4  53.86,76.35 180 top
J5  72.15,83.26 180 top
L1  95.49,64.71 90 top
L2  125.06,70.05 180 top
LCD  91.52,26.24 0 top
LCD_CONN  108.79,65.1 180 top
LED2  65.32,40.51 270 top
LED3  65.27,43.16 270 top
Q1  60.52,66.22 0 top
Q2  98.77,86.81 90 top
Q3  88.56,87.26 90 top
Q4  98.72,78.09 90 top
Q5  88.43,78.3 90 top
Q6  98.69,82.44 90 top
Q7  88.53,82.51 90 top
R1  74.3,50.65 180 top
R2  89.9,39.97 90 top
R3  53.49,55.83 180 top
R6  43.79,65.6 180 top
R7  83.06,46.51 0 top
R8  65.21,37.67 0 top
R9  65.27,46.25 0 top
R10  110.98,84.35 0 top
R11  93.36,78.17 270 top
R12  103.51,78 270 top
R13  93.49,87.16 270 top
R14  103.57,86.73 270 top
R15  93.36,82.44 270 top
R16  103.34,82.31 270 top
R17  32.91,3.05 180 top
R18  30.62,6.48 90 top
R19  30.62,10.29 90 top
R20  31.76,14.1 0 top
R21  51.96,10.67 270 top
R22  52.72,2.67 180 top
R23  27.45,4.75 90 top
R24  27.09,8.89 90 top
R25  26.81,12.95 90 top
R26  56.53,14.86 0 top
R27  52.34,6.86 270 top
R28  92.72,3.81 270 top
R29  69.86,3.05 90 top
R30  69.86,6.86 90 top
R31  69.86,10.67 90 top
R32  88.91,12.95 0 top
R33  89.68,5.33 270 top
R34  62.62,2.29 180 top
R35  66.44,4.95 90 top
R36  66.44,9.53 90 top
R37  72.53,12.19 90 top
R38  91.58,10.29 270 top
R39  132.47,5.33 270 top
R40  108.34,3.43 90 top
R41  108.34,7.24 90 top
R42  108.34,11.05 90 top
R43  126.63,14.48 0 top
R44  128.54,6.86 270 top
R45  129.68,3.43 270 top
R46  104.15,4.95 90 top
R47  104.53,9.14 90 top
R48  111.01,13.72 180 top
R49  131.59,10.29 270 top
R50  141.21,72.54 180 top
R51  127.7,78.94 180 top
R52  136.21,69.06 90 top
R53  133.92,69.06 90 top
S1  41.9,7.18 0 top
S2  80,7.18 0 top
S3  118.1,7.18 0 top
S4  16.5,64.59 0 top
S5  143.5,64.59 0 top
SJ1  78.56,53.07 180 top
VCC!  48.4,67.4 270 top

### Tracks (layer width: path | path; a pad name or v marks a point on that pad's centre or on a via)
3.3V  (via drill 0.35)
  Top 0.152: IC4.18 105.78,75.35 | LCD_CONN.P4 117.04,62.27 117.03,62.28 | IC4.16 106.38,75.96 106.81,75.53 106.81,75.27 106.48,74.94 106.19,74.94 105.78,75.35 | IC4.18 | IC4.18 105.78,75.35
  Top 0.2: 106.38,75.99 IC4.16
  Top 0.254: IC4.9 110.88,77.09
  Top 0.305: 117.04,62.86 117.04,62.27 | 105.09,75.95 IC4.18 | IC9.14 91.88,74.38 91.87,74.37
  Top 0.406: v102.94,75.18 103.7,75.95 105.09,75.95 | v114.97,71.65 117.04,69.59 117.04,62.86
  Top 0.813: C14.1 118,80.11 v113.96,80.11 | C9.1 90.57,74.61 v90.81,74.37 | 113,80.11 111.83,81.28
  Top 0.889: IC6.5 C14.1 | 111.83,81.28 R10.2 | v113.96,80.11 113.89,80.11 | v113.96,80.11 113,80.11 | v113.96,80.11 113.9,80.11 110.88,77.09 | v90.81,74.37 91.87,74.37
  Bottom 0.406: 114.97,71.68 v114.97,71.65
  Bottom 0.889: v102.94,75.18 102.12,74.37 v90.81,74.37 98.05,67.13 109.89,67.13 114.42,71.65 v114.97,71.65 115.92,72.6 115.92,78.13 113.96,80.09 v113.96,80.11
5V_REG_IN  (via drill 0.35)
  Top 0.889: C23.1 34.19,64.68 D3.C | C23.1 29.73,64.69 | C23.1 29.43,64.98 v29.43,67.26 | v21.86,68.73 20.19,70.4 IC8.3
  Bottom 0.889: v29.43,67.26 23.33,67.26 v21.86,68.73
12V
  Top 0.61: Q3.P$3 89.56,87.88 88.59,86.91 88.59,85.71 89.53,84.77 Q7.P$3 89.53,83.13 88.56,82.16 88.56,80.96 89.43,80.09 Q5.P$3
  Top 0.813: 123.19,80 123.19,79.5 C10.1 | R51.2 124.24,78.94 123.19,80 | C12.1 123.22,80.02 123.19,80
  Top 0.889: C12.1 123.19,81.2 C22.1 123.2,83.7 123.2,87.38 121.22,89.36 89.55,89.36 | C10.1 C15.1 123.19,73.99 L2.1 | 50.39,77.46 50.38,77.46 | 40.8,63.12 J2.P$4 | 40.8,63.12 40.8,66.17 40.81,66.18 40.81,67.58 | 50.38,77.46 50.38,85.85 53.38,89.36 89.55,89.36 | 89.56,87.95 89.56,87.88 | D3.A 39.23,64.69 40.8,63.12 | 40.81,67.58 46.91,73.69 48.32,73.69 50.38,75.75 50.38,77.46 | J3.P$1 39.69,68.7 40.81,67.58 | Q3.P$3 89.56,89.35 89.55,89.36
AVR_CS
  Top 0.305: IC9.2 92.62,69.99 92.62,70.23 91.45,71.4 80.91,71.4 80.73,71.22 80.73,70.71 IC1.10
AVR_MISO
  Top 0.305: IC9.6 98.39,72.87 98.97,73.45 98.97,75.31 97.73,76.55 95.46,76.55 95.24,76.33 93.83,76.33 93.83,76.32 92.93,76.32 92.72,76.12 92.72,74.22 92.62,74.12 92.62,73.45 91.94,72.77 79.88,72.77 78.33,71.22 78.33,70.71 IC1.13
AVR_MOSI
  Top 0.305: IC1.12 79.13,70.71 79.13,71.22 80.22,72.31 93.28,72.31 93.64,71.96 94.2,71.96 94.6,72.36 94.6,72.93 94.58,72.95 IC9.12 94.58,73.65
AVR_SCLK  (via drill 0.35)
  Top 0.305: IC1.11 79.93,70.71 79.93,71.22 80.56,71.86 92.26,71.86 | 92.26,71.86 93.09,71.86 93.45,71.5 94.39,71.5 95.17,72.29 96.53,72.29 97.7,73.45 97.7,73.7 IC9.9 | 92.26,71.86 93.89,70.23 93.89,68.45 93.91,68.45 94.17,68.2 96.41,68.2 97.55,67.06 97.55,62.27 v92.43,57.15 | v89.64,53.02 89.69,52.96 H7.3
  Bottom 0.305: v92.43,57.15 89.53,54.25 89.53,53.42 89.64,53.32 v89.64,53.02
B2
  Top 0.152: LCD_CONN.P23 107.54,63.93 106.75,64.72 106.75,67.47 106.65,67.58 106.65,67.91 IC4.35
B3
  Top 0.152: LCD_CONN.P24 107.03,63.38 106.28,64.14 106.28,68.26 IC4.34
B4
  Top 0.152: LCD_CONN.P25 106.53,63.05 106.12,63.45 106.12,63.83 105.95,64 105.95,68.48 106.38,68.92 IC4.33
B5
  Top 0.152: LCD_CONN.P26 106.04,63.06 105.57,63.54 105.57,68.95 IC4.32
B6
  Top 0.152: LCD_CONN.P27 105.54,63.1 105.02,63.62 105.02,69.12 IC4.31
B7
  Top 0.152: LCD_CONN.P28 105.03,63.15 104.47,63.7 104.47,69.28 IC4.30
BL_ANODE
  Top 0.305: 118.02,63.04 118.02,61.69 LCD_CONN.P2
  Top 0.889: R53.1 132.27,68.21 C4.2 C3.2 121.19,68.21 D2.P$2 119.83,69.45 118.02,67.64 118.02,63.04
CAN_0H
  Top 0.61: IC2.7 52.94,59.31 52.65,59.01 50.84,59.01 50.81,59.05 IC3.2 46.53,59.05 43.54,56.05 43.54,50.29 J2.P$2
CAN_0L
  Top 0.61: IC2.6 54.64,60.98 50.84,60.98 50.81,60.95 IC3.1 47.32,60.95 42.75,56.38 42.75,51.6 J2.P$3
CAN_1H  (via drill 0.35)
  Top 0.61: v33.66,73.39 33.69,73.35 J3.P$3
  Bottom 0.61: 33.59,73.34 v33.66,73.39 32.62,72.4 32.82,54.05 J2.P$7
CAN_1L  (via drill 0.35)
  Top 0.508: v30.78,73.26 30.78,70.87 J3.P$4
  Bottom 0.61: 30.84,73.24 v30.78,73.26 31.73,72.41 31.93,53.49 35.2,50.22 J2.P$8
D+
  Top 0.254: J1.P$3 56.12,51.8 57.62,53.3 67.97,53.3 70.11,51.17 IC5.15
D-
  Top 0.254: 57.82,53.73 57.48,53.73 55.33,51.59 55.33,50.46 55.56,50.23 J1.P$2 | 57.82,53.73 | IC5.16 71.03,47.47 71.79,48.24 71.79,50.1 68.4,53.5 | 68.4,53.5 | 68.4,53.5 68.16,53.73 57.82,53.73
DATA_EN
  Top 0.152: LCD_CONN.P34 102.03,70.37 IC4.25
DCLK
  Top 0.152: LCD_CONN.P30 104.04,69.57 IC4.29
DISP_EN
  Top 0.152: LCD_CONN.P31 103.53,69.75 IC4.28
DOWN_SH  (via drill 0.35)
  Top 0.61: v52.41,80.14 52.36,80.08 J4.P$3
  Bottom 0.61: J2.P$6 37.2,55.96 37.91,56.67 37.91,77.7 40.35,80.14 v52.41,80.14
DRV1
  Top 0.813: F5.2 80.67,81.42 79.89,80.63 76.49,80.63 J5.P$2
DRV2
  Top 0.813: F4.2 74.56,86.32 70.66,82.19 J5.P$3
DRV3
  Top 0.813: F3.2 69.94,75.5 J5.P$4
DTR
  Top 0.254: IC5.2 84.24,40.32 85.55,41.64 85.55,44.34 85,44.89 83.68,44.89 83.04,45.53 83.04,47.37 82.35,48.06 C20.1
FT801_CS_N  (via drill 0.35)
  Top 0.305: IC4.6 110.89,75.01 111.56,75.68 v111.56,76.39 | v97.37,71.83 96.72,71.83 95.9,71.83 94.58,70.51 IC9.3
  Bottom 0.305: v97.37,71.83 101.29,71.83 104.14,74.68 104.14,75.26 105.76,76.88 111.07,76.88 v111.56,76.39
FT801_MISO  (via drill 0.35)
  Top 0.305: IC4.4 111.59,74.32 112.68,75.4 v113.23,75.4 | IC9.5 97.12,68.76 97.8,68.07 100.43,68.07 v100.47,68.11
  Bottom 0.305: v113.23,75.4 113.35,75.28 113.35,72.31 109.14,68.11 v100.47,68.11
FT801_MOSI  (via drill 0.35)
  Top 0.305: IC4.5 111.25,74.7 112.51,75.96 112.51,77.31 v112.92,77.72 | IC9.11 95.85,72.98 v95.83,72.97
  Bottom 0.305: v112.92,77.72 112.53,77.34 105.57,77.34 103.68,75.45 103.68,74.87 101.78,72.97 v95.83,72.97
FT801_SCLK  (via drill 0.35)
  Top 0.305: v100.95,75.82 100.95,75.68 IC9.8 | v114.62,77.72 113.91,77.02 113.91,75.12 113.51,74.72 112.74,74.72 IC4.3
  Bottom 0.305: v114.62,77.72 113.88,77.72 113.2,78.41 111.96,78.41 111.35,77.8 102.93,77.8 v100.95,75.82
G2
  Top 0.152: LCD_CONN.P15 111.53,68.78 IC4.42
G3
  Top 0.152: LCD_CONN.P16 111.05,68.55 IC4.41
G4
  Top 0.152: LCD_CONN.P17 110.54,68.37 IC4.40
G5
  Top 0.152: LCD_CONN.P18 110.03,68.16 IC4.39
G6
  Top 0.152: LCD_CONN.P19 109.55,67.93 IC4.38
G7
  Top 0.152: LCD_CONN.P20 109.04,63.07 108.66,63.45 108.66,67.91 IC4.37
GND  (via drill 0.35, 6.35 pad 6.35)
  Top 0.254: IC4.2 | IC4.15 | IC4.15 | IC4.2 112.33,73.57 | 108.11,75.04 IC4.EP | 108.11,75.04 IC4.10 | IC4.EP 108.11,75.04 | 108.11,75.04 IC4.15 | IC4.EP 108.11,76.44 IC4.13 | IC4.EP 104.91,72.56 IC4.23 | IC4.EP 111.31,72.56 IC4.2 | IC4.EP 108.11,68.69 IC4.36
  Top 0.305: LCD_CONN.P13 112.55,60.16 | 108.53,60.13 108.5,60.1 | 108.03,60.66 LCD_CONN.P22 | LCD_CONN.P6 116.03,60.54 116.04,60.53 | LCD_CONN.P5 116.53,60.42 116.55,60.4 | 118.54,60.72 LCD_CONN.P1 118.54,62.47 | 118.54,60.72 | LCD_CONN.P36 101.04,60.36 101.05,60.34 | LCD_CONN.P29 104.55,60.07 104.57,60.05 | LCD_CONN.P3 117.53,60.37 117.49,60.34
  Top 0.406: 112.55,60.16 112.48,60.1 | LCD_CONN.P14 112.04,60.31 112,60.27 | 108.53,60.13 LCD_CONN.P21 | 108.03,60.66 107.81,60.45
  Top 0.508: v47.69,59.97 47.72,60
  other vias: 132.86,73.03 88.34,45.6 74.69,45.95 91.58,60.78 122.67,72.26 69.51,69.44 76.04,61.7 128.23,71.83 18.68,79.15 132.2,88.21 141.52,79.58 140.04,55.93 141.47,12.88 19.27,13.18 18.43,53.67 141.49,77.32 141.54,75.03 72.51,41.72 71.46,37.41 89.99,70.13 111.08,79.29 29.81,56.75 35.86,57.54 55.39,87.12 58.69,87.12 61.99,87.12 111.01,87.63 74.18,82.04 29.73,87.38 33.29,87.38 36.59,87.38 39.89,87.38 100.75,70.53 114.79,75.27 114.75,76.26 118.96,78.52 118.96,76.34 79.76,46.05 81.24,52.95 82.97,41.47 96.3,75.77 72.1,46.31 96.87,70.73 22,84 6,64 22,7 138,7 154,64 138,84
  pour Top (isolate 0.178): -9,96.6 162.57,96.6 164.81,94.36 163.98,-5.76 162.63,-7.11 -12.74,-6.94 -14.67,-5.01 -14.51,91.11 -14.49,91.11
  pour Bottom (isolate 0.254): -9.1,96.62 162.57,96.62 164.86,94.34 164.03,-5.53 162.63,-6.93 -13.07,-6.76 -14.72,-5.11 -14.57,91.16
HSYNC
  Top 0.152: LCD_CONN.P32 103.05,69.98 IC4.27
INT_N  (via drill 0.35)
  Top 0.254: IC4.11 109.11,76.86 109.59,77.33 109.59,77.57 v109.59,78.64
  Top 0.305: v81.32,68.43 IC1.9
  Bottom 0.305: v109.59,78.64 102.3,78.64 101.75,78.08 90.97,78.08 v81.32,68.43
M8RXD
  Top 0.305: IC5.1 78.02,39.02 R2.1
M8TXD
  Top 0.305: IC5.5 78.59,42.27 82.11,45.79 R7.1
N$2
  Top 0.305: 105.54,79.67 C8.1 105.43,79.56 105.43,76.32 IC4.17
N$3
  Top 0.254: IC4.12 108.77,77.27
  Top 0.305: C7.1 109.96,84.19 R10.1
  Top 0.508: C7.1 107.86,84.16 107.86,79.17 108.77,78.26 108.77,77.27
N$4
  Top 0.305: C5.1 142.3,72.35 R50.1
N$5  (via drill 0.35)
  other vias: 94.63,45.13
N$6
  Top 0.152: 55.04,56.43 R3.1
  Top 0.305: IC2.8 55.04,56.43
N$9
  Top 0.305: R6.1 46.2,67.41 VCC!.A
N$11
  Top 0.305: 55.66,66.25 Q1.1
  Top 0.406: IC1.24 73.18,63.13 72.63,62.59 C1.2 69.84,62.59 69.12,63.31 61.34,63.31 60.55,64.1 60.55,65.24 59.56,66.22 Q1.1
N$22
  Top 0.305: L1.2 93.5,68.2 91.63,68.2 91.09,68.74 IC1.64
N$27
  Top 0.813: Q4.P$2 103.5,77.14 R12.2
N$28
  Top 0.813: Q5.P$2 93.33,77.35 R11.2
N$29
  Top 0.813: R11.1 96.79,79.02 Q4.P$1
N$30
  Top 0.813: F3.1 Q5.P$1
N$31
  Top 0.813: Q2.P$2 103.55,85.86 R14.2
N$32
  Top 0.305: LED2.C 68.78,42.92 IC5.23
N$33
  Top 0.813: Q3.P$2 R13.2
N$34
  Top 0.305: LED3.C 66.74,43.57 IC5.22
N$35
  Top 0.305: LED2.A R8.1
N$36
  Top 0.305: LED3.A 64.22,46.16 R9.1
N$37
  Top 0.813: R13.1 96.56,88.01 Q2.P$1
N$38
  Top 0.635: F4.1 85.29,87.26 Q3.P$1
N$39
  Top 0.813: Q6.P$2 103.31,81.49 R16.2
N$40
  Top 0.813: Q7.P$2 93.33,81.56 R15.2
N$41
  Top 0.813: R15.1 96.84,83.29 Q6.P$1
N$42
  Top 0.813: F5.1 85.83,84.22 Q7.P$1
N$43  (via drill 0.35)
  Top 0.305: R17.1 34.05,3.34
  Top 0.508: R22.2 46.31,2.67 S1.P$2 | 34.05,3.34 v34.05,4.57
  Bottom 0.305: v34.05,4.57 37.78,4.57 38.17,4.96 44.12,4.96 S1.P$2
N$44
  Top 0.305: S1.P$3 42.06,1.17 33.94,1.17 R17.2
  Top 0.508: R17.2 31.2,3.9 R23.1
N$45
  Top 0.305: R18.1 30.76,5.64 31.3,5.71
  Top 0.508: 31.3,5.71 34.43,5.71 36.8,2.59 S1.P$4 | 30.72,5.6 30.76,5.64 | R18.1 27.47,5.63 R23.2
N$46
  Top 0.305: S1.P$5 37.88,3.79 | 30.71,7.24 R18.2
  Top 0.508: 37.88,3.79 34.43,7.24 30.71,7.24 | R18.2 27.8,7.33 R24.1
N$47
  Top 0.305: 30.62,13.8 R20.1 31.13,14.1
  Top 0.508: R25.2 30.62,13.8 | 31.13,14.1 32.37,12.48 36.12,12.48 S1.P$8
N$48
  Top 0.305: S1.P$9 41.05,11.57 | 55.3,14.48 R26.1
  Top 0.508: S1.P$9 38.17,14.1 R20.2 | 41.05,11.57 43.96,14.48 55.3,14.48
N$49
  Top 0.508: S1.P$6 33.85,9.44 R19.1 30.32,9.74 R24.2
N$50
  Top 0.508: S1.P$7 34.56,11.14 R19.2 27.78,11.14 R25.1
N$51
  Top 0.305: 51.91,11.57 R21.1 52.05,11.43
  Top 0.508: 51.91,11.57 S1.P$10 | 52.05,11.43 55.39,11.43 57.38,13.42 R26.2
N$52
  Top 0.305: S2.P$2 83.98,4.48 | R33.2 89.85,4.66
  Top 0.508: 83.98,4.48 R33.2 | 89.85,4.66 R28.1
N$53
  Top 0.305: R27.1 51.96,8.09
  Top 0.508: S1.P$11 45.74,9.82 R21.2 51.96,8.09
N$54
  Top 0.305: R34.1 64.15,2.29 65.27,1.17 79.78,1.17 S2.P$3
  Top 0.508: R28.2 91.67,1.91 81.89,1.91 S2.P$3
N$55
  Top 0.305: 78.41,2.2 S2.P$4 | R34.2 61.77,2.58 | 69.78,2.29 R29.1
  Top 0.508: R29.1 78.41,2.2 | 61.77,2.58 63.01,3.81 64.15,3.81 65.67,2.29 69.78,2.29
N$56
  Top 0.305: 69.66,4.1 R29.2 | 76.61,3.9 S2.P$5
  Top 0.508: R35.1 69.66,4.1 | R29.2 76.61,3.9
N$57
  Top 0.305: 76.16,9.82 S2.P$8 | 66.99,9.82 R36.2
  Top 0.508: 76.16,9.82 R31.1 66.99,9.82
N$58
  Top 0.305: 78.59,11.78 S2.P$9
  Top 0.508: R31.2 70.04,11.34 R37.1 75.11,11.34 75.58,11.81 78.56,11.81 78.59,11.78
N$59
  Top 0.305: 75.38,6.01 S2.P$6 | 69.66,5.8 R30.1
  Top 0.508: R30.1 75.38,6.01 | R35.2 69.66,5.8
N$60
  Top 0.305: R36.1 66.52,8.68 | 69.78,7.62 R30.2 | 74.94,7.71 S2.P$7
  Top 0.508: 66.52,8.68 67.58,7.62 69.78,7.62 | R30.2 74.94,7.71
N$61
  Top 0.305: S2.P$10 81.83,12.19
  Top 0.508: R32.1 87.3,12.19 81.83,12.19 | R37.2 72.62,12.95 79.39,12.95 80.77,11.57 S2.P$10
N$62
  Top 0.508: S2.P$11 84.06,11.14 R38.1 R32.2
N$63
  Top 0.152: 128.71,6.18 R44.2 128.45,6.1
  Top 0.508: 128.71,6.18 R39.1 | S3.P$2 122.81,3.79 125.11,6.1 128.45,6.1
N$64
  Top 0.152: 129.89,4.48 R45.1 129.39,4.57
  Top 0.508: R39.2 129.89,4.48 | S3.P$3 124.27,2.59 126.25,4.57 129.39,4.57
N$65
  Top 0.152: 116.9,2.06 116.9,2.59 S3.P$4
  Top 0.305: R40.1 116.89,2.58 116.9,2.59
  Top 0.508: R45.2 126.11,1.47 117.87,1.47 116.9,2.06
N$66
  Top 0.305: 108.83,3.79 R40.2 | 104.33,4.28 R46.1
  Top 0.508: S3.P$5 108.83,3.79 | R40.2 104.33,4.28
N$67
  Top 0.305: 108.51,10.37 R42.1 | 104.74,10.2 R47.2
  Top 0.508: S3.P$8 108.51,10.37 | R42.1 104.74,10.2
N$68
  Top 0.152: S3.P$9 116.57,11.9
  Top 0.508: 113.68,11.9 R42.2 | 113.68,11.9 116.57,11.9 | R48.1 113.68,11.9
N$69
  Top 0.305: S3.P$6 113.1,6.39 | R41.1 107.76,5.8
  Top 0.508: 113.1,6.39 R41.1 | 107.76,5.8 R46.2
N$70
  Top 0.305: 108.14,8.29 R41.2 | 113.42,8.09 S3.P$7
  Top 0.508: R47.1 108.14,8.29 | R41.2 113.42,8.09
N$71
  Top 0.305: S3.P$10 119.47,11.74
  Top 0.508: 119.47,11.74 122.21,14.48 R43.1 | R48.2 111.31,14.86 116.01,14.86 S3.P$10
N$72
  Top 0.508: R49.1 128.25,14.48 R43.2 123.37,10.37 S3.P$11
N$75
  Top 0.305: IC7.COMP 136.73,72.16 C21.1 138.67,72.32 138.9,72.54 R50.2
N$77
  Top 0.305: C11.1 126.32,75.3 | R51.1 128.49,78.88 128.49,77.02 C11.1 | IC7.VIN 127.51,73.66 C11.1
N$79  (via drill 0.35)
  Top 0.305: IC7.SW1 IC7.SW2 IC7.SW3 129.88,76.84 v129.86,76.86 | D2.P$1 119.83,73.21 L2.2 v125.06,70.05
  Bottom 0.305: v129.86,76.86 129.86,74.85 v125.06,70.05
N$82
  Top 0.305: R52.2 R53.2 133.92,72.26 134.29,72.66 134.64,72.66 IC7.FB
N$85
  Top 0.254: 131.03,73.53 130.75,73.25 130.65,73.16 IC7.SS
  Top 0.305: 130.75,73.25 133.42,75.92 133.42,75.95 133.58,76.12 C6.1
N$87
  Top 0.305: IC7.BYP 129.92,74.2 130.4,74.2 132.35,76.15 132.35,78.61 133.44,79.7 C17.1
PB5(PWM)  (via drill 0.35)
  Top 0.152: 103.42,78.77 R12.1
  Top 0.305: IC1.15 76.51,71.32 v77.31,72.11 | v101.46,78.77 103.42,78.77
  Bottom 0.152: v77.31,72.11 77.41,72.11 | 101.41,78.82 v101.46,78.77
  Bottom 0.305: 77.41,72.11 84.11,78.82 101.41,78.82
PB6(PWM)  (via drill 0.35)
  Top 0.152: 103.29,83.11 R16.1
  Top 0.305: IC1.16 75.71,72.75 v76.16,73.2 | v101.26,83.11 103.29,83.11
  Bottom 0.152: v76.16,73.2 76.27,73.2 | 101.39,83.08 v101.26,83.11
  Bottom 0.305: 76.27,73.2 86.14,83.08 v101.26,83.11
PB7(PWM)  (via drill 0.35)
  Top 0.305: IC1.17 73.95,73.23 v75.05,74.32 | v101.56,87.58 R14.1
  Bottom 0.152: v75.05,74.32 75.05,74.37 | 101.44,87.61 v101.56,87.58
  Bottom 0.305: 75.05,74.37 89.4,87.61 101.44,87.61
PC0  (via drill 0.35)
  Top 0.305: IC1.35 77.3,55.17 77.3,55.75 77.09,55.88 69.3,55.88 v69.23,55.96
  Bottom 0.305: v69.23,55.96 58.35,45.08 33.57,45.08 19.24,59.41 13.55,59.41 11.47,61.49 11.47,64.56 S4.P$1
PC1  (via drill 0.35)
  Top 0.305: IC1.36 78.11,56.13 v80.53,58.55 | 138.45,64.64 S5.P$1
  Bottom 0.305: v80.53,58.55 87.52,58.55 92.95,63.98 137.89,63.98 S5.P$1
PF0  (via drill 0.35)
  Top 0.305: IC1.61 92.13,66.34 v92.78,66.98
  Bottom 0.305: v92.78,66.98 92.78,66.63 93.55,65.85 93.55,65.21 93.1,64.76 77.09,64.76 72.13,59.79 72.19,55.11 46.86,29.79 45.64,28.57 45.64,12.43 44.12,10.91 44.12,9.4 S1.P$13
PF1  (via drill 0.35)
  Top 0.305: IC1.60 91.04,65.54 v93.28,63.3
  Bottom 0.305: S3.P$13 120.32,9.4 120.32,10.91 129.12,19.7 129.12,21.39 130.01,22.29 130.01,24.96 93.28,61.69 v93.28,63.3
PF2  (via drill 0.35)
  Top 0.305: IC1.59 90.11,64.74 v92.39,62.46
  Bottom 0.305: S2.P$13 82.22,9.4 82.22,10.91 92.17,20.85 127.93,20.85 129.55,22.48 129.55,24.77 92.39,61.93 v92.39,62.46
R2
  Top 0.152: LCD_CONN.P7 115.54,69.01 IC4.48
R3
  Top 0.152: LCD_CONN.P8 115.03,68.83 IC4.47
R4
  Top 0.152: LCD_CONN.P9 114.53,68.62 IC4.46
R5
  Top 0.152: LCD_CONN.P10 114.05,68.39 IC4.45
R6
  Top 0.152: LCD_CONN.P11 113.54,68.21 IC4.44
R7
  Top 0.152: LCD_CONN.P12 113.03,68 IC4.43
RESET  (via drill 0.35)
  Top 0.508: v77.94,58.12 77.94,65.51 77.11,66.34 74.13,66.34 IC1.20 | v74.42,54.5 75.85,53.07 D1.A | D1.A 76.25,51.65 | 76.25,51.65 R1.1 | D1.A SJ1.2 | SJ1.2 | 76.25,51.65 77.92,49.98 C16.1 80.51,50.84 C20.2 86.14,50.84 H7.5
  Bottom 0.508: v77.94,58.12 74.44,54.62 74.42,54.6 v74.42,54.5
RX
  Top 0.305: IC1.2 87.13,70.28 87.13,57.77 95.51,49.4 95.51,47.47 94.21,46.17 92.13,46.17 H7.4 89.88,43.75 | 89.88,43.75 90.12,43.77 | R2.2 89.88,40.94 89.88,43.75
RXCAN
  Top 0.305: IC1.31 63.14,57.54 62.75,57.15 60.21,57.15 59.7,57.66 59.7,61.21 60.47,61.98 60.59,61.85 IC2.4
TX
  Top 0.305: IC1.3 86.33,70.28 86.33,57.93 92.23,52.03 H7.1 88.91,46.51 R7.2
TXCAN
  Top 0.305: IC2.1 72.78,58.04 73.17,58.42 73.87,58.42 IC1.30
UP_SH  (via drill 0.35)
  Top 0.61: v55.31,76.3 55.31,70.94 J4.P$2
  Bottom 0.61: 38.91,52.89 J2.P$5 39,77.36 40.62,78.98 53.98,78.98 55.28,77.27 v55.31,76.3
VCC  (via drill 0.35)
  Top 0.508: S3.P$1 124.42,7.71 R44.1 | S2.P$1 89.37,5.88 R33.1 93.54,6.18 v94.44,7.09 | 52.07,4.17 R22.1 | 95.76,62.76 91.4,58.22 | IC1.52 90.41,59.14 91.4,58.22 | 70.08,44.85 IC5.20 | R9.2 67.54,46.25 68.27,45.52 IC5.19 IC5.20 | IC5.20 73.23,44.87 | 73.23,44.87 76.45,41.65 77.33,41.65 | S1.P$1 46.39,5.57 47.77,4.19 52.05,4.19 52.07,4.17 | v57.67,4.17 52.07,4.17 | v76.77,65.53 IC1.21 | 91.4,58.22 91.4,54.8 96.65,49.56 96.65,45.29 95.16,43.81 92.7,43.81 H7.2 | IC5.4 77.33,41.65 | 73.23,44.87 73.23,50.53 R1.2 73.35,52.27 D1.C | C19.1 80.44,41.65 77.33,41.65
  Top 0.813: 115.11,84.51 IC6.3 115.28,84.34 | 119.69,84.4 C13.1 | 115.64,83.17 115.68,83.21 116.69,83.21 117.03,83.55 117.03,85.24 117.03,86.31 v117.01,86.33 | D1.C 70.86,54.76 65.82,54.76 64.76,55.82 v64.76,55.84
  Top 0.889: 119.69,84.4 IC6.1 117.07,84.34 117.07,83.54 116.71,83.17 115.64,83.17 115.28,83.54 115.28,84.34 | R9.2 65.59,46.88 65.59,47.26 65.22,47.63 63.41,47.63 60.2,44.42 | L1.1 95.76,62.76 93.14,65.53 v92.78,65.53 | v67.81,60.6 61.21,60.6 IC2.3 | 39.49,44.45 28.23,44.45 26.77,45.91 C24.1 26.77,71.16 25.11,72.82 | 39.49,44.45 40.58,43.36 40.58,19.94 43.4,17.12 58.18,17.12 59.42,15.88 59.42,13.89 57.67,12.14 v57.67,4.17 | 42.91,65.69 R6.2 42.84,62.41 v42.8,62.36 | 66.08,37.58 R8.2 66.16,36.41 65.72,35.97 61.43,35.97 60.21,37.19 60.21,44.41 60.2,44.42 | 60.2,44.42 60.17,44.45 50.75,44.45 | 50.75,44.45 39.49,44.45 | 50.65,44.55 50.71,44.49 | J1.P$1 52.04,50.98 50.71,49.65 50.71,44.49 | 50.71,44.49 50.75,44.45 | 25.11,72.82 IC8.4 | IC8.2 19.07,72.82 25.11,72.82
  Bottom 0.508: S3.P$1 119.94,5.88 118.63,4.57 117.11,4.57 114.51,7.17 113.11,7.17 113.02,7.07 102.15,7.07 102.14,7.09 v94.44,7.09 | S2.P$1 83.6,5.09 78.09,5.09 76,7.17 75.02,7.17 72.01,4.17
  Bottom 0.813: v117.01,86.33 117.01,69.24 112.87,65.1 96.97,65.1 93.51,68.56 87.82,68.56 84.8,65.53 | v64.76,55.84 67.81,58.88 v67.81,60.6
  Bottom 0.889: v92.78,65.53 84.8,65.53 v76.77,65.53 70.52,59.28 69.13,59.28 v67.81,60.6 67.81,62.81 66.89,63.73 51.91,63.73 50.61,62.43 46.73,62.43 46.7,62.41 v42.8,62.36 | v57.67,4.17 72.01,4.17
VCC3O
  Top 0.508: IC5.17 70.06,46.88 69.21,46.88 68.95,47.14 68.95,47.36 C18.1
VSYNC
  Top 0.152: LCD_CONN.P33 102.54,70.19 IC4.26
XTAL1
  Top 0.406: IC1.23 73.05,63.95 72.58,64.42 C2.2 69.81,64.42 69.25,63.87 68.89,63.87 | Q1.2 62.24,66.22 61.23,65.21 61.23,64.31 61.67,63.87 68.89,63.87 | 68.89,63.87

### Text on the board
tNames: N. Luong, A. Painter, N. Mah / J. Singh, D. Zusalim, / D. Baron, T. Willson | DASHBOARD Rev. 4 - 2018